# EAGLE design ECEN 4350 Lab 3 (EAGLE 9.6.2)

## Sheet 1 of 8
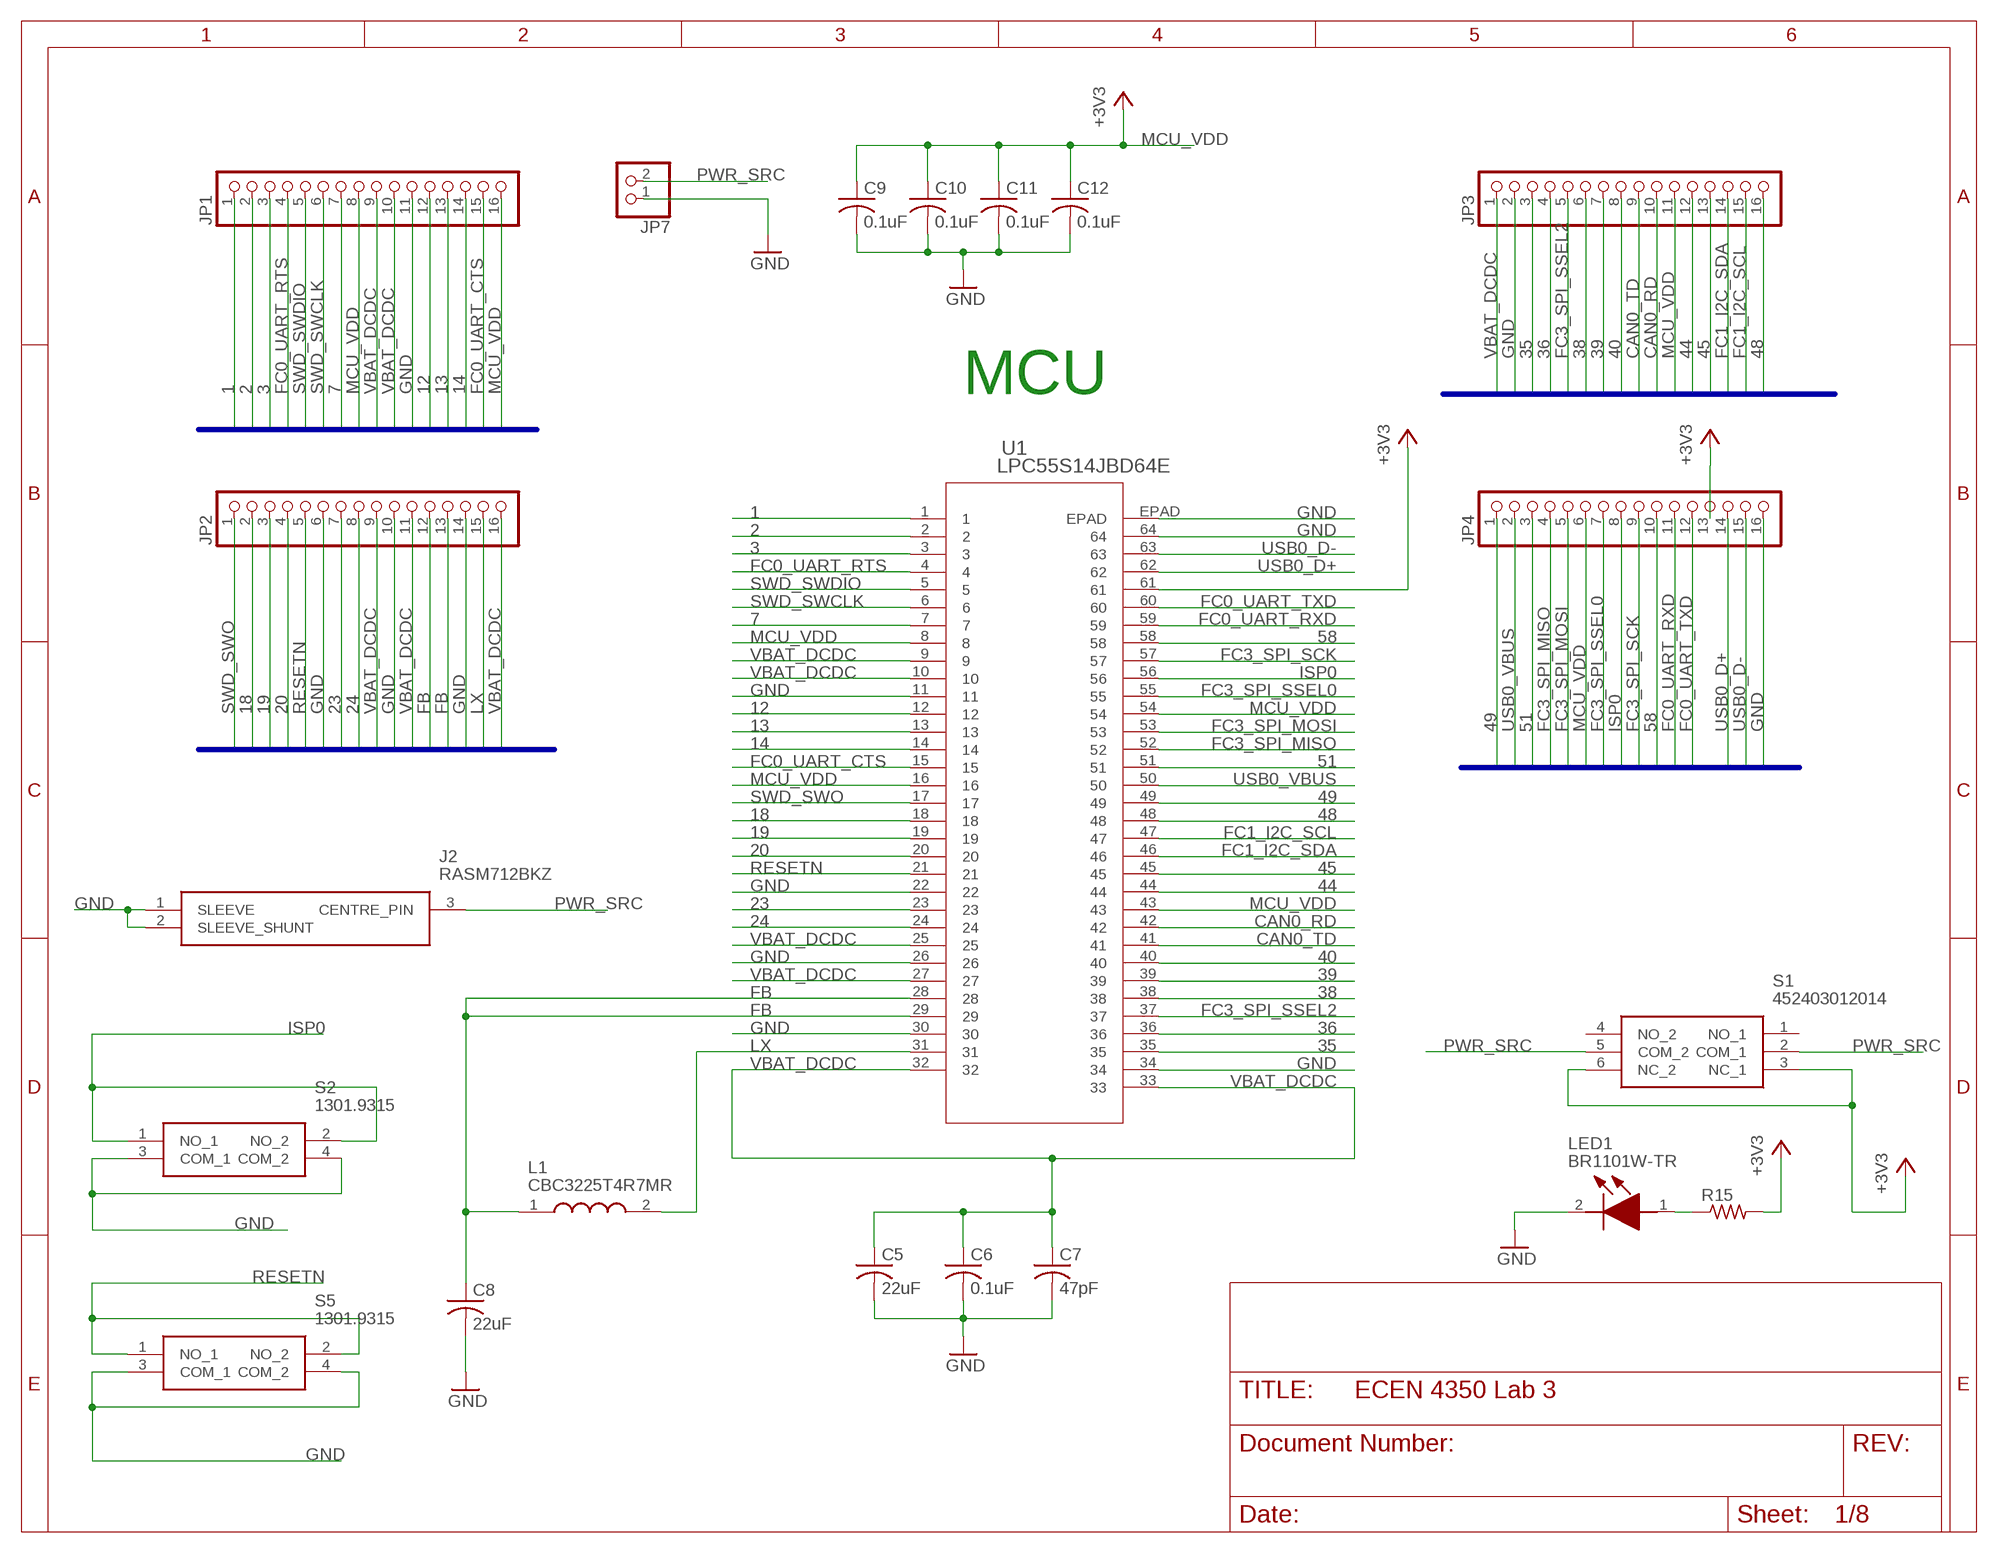
[diagram p0: schematic, sheet 1]

### Parts
C5  22uF  C-USC1206  [C1206]
C6  0.1uF  C-USC1206  [C1206]
C7  47pF  C-USC1206  [C1206]
C8  22uF  C-USC1206  [C1206]
C9  0.1uF  C-USC1206  [C1206]
C10  0.1uF  C-USC1206  [C1206]
C11  0.1uF  C-USC1206  [C1206]
C12  0.1uF  C-USC1206  [C1206]
J2  RASM712BKZ  [RASM712BKZ]
JP1  PINHD-1X16  [1X16]
JP2  PINHD-1X16  [1X16]
JP3  PINHD-1X16  [1X16]
JP4  PINHD-1X16  [1X16]
JP7  PINHD-1X2  [1X02]
L1  CBC3225T4R7MR  [INDC3225X270N]
LED1  BR1101W-TR  [BR1101WTR]
R15  R-US_R1206  [R1206]
S1  452403012014  [452403012014]
S2  1301.9315  [13019319]
S5  1301.9315  [13019319]
U1  LPC55S14JBD64E  [HTQFP64_10X10_NXP]

### Nets
1: JP1.1 U1.1
2: JP1.2 U1.2
3: JP1.3 U1.3
7: JP1.7 U1.7
12: JP1.12 U1.12
13: JP1.13 U1.13
14: JP1.14 U1.14
18: JP2.2 U1.18
19: JP2.3 U1.19
20: JP2.4 U1.20
23: JP2.7 U1.23
24: JP2.8 U1.24
35: JP3.3 U1.35
36: JP3.4 U1.36
38: JP3.6 U1.38
39: JP3.7 U1.39
40: JP3.8 U1.40
44: JP3.12 U1.44
45: JP3.13 U1.45
48: JP3.16 U1.48
49: JP4.1 U1.49
51: JP4.3 U1.51
58: JP4.10 U1.58
+3V3: R15.2 S1.3(NC_1) S1.6(NC_2) U1.61 ; also sheet 3,4,5,6,7,8
CAN0_RD: JP3.10 U1.42 ; also sheet 3
CAN0_TD: JP3.9 U1.41 ; also sheet 3
FB: C8.1 JP2.12 JP2.13 L1.1 U1.28 U1.29
FC0_UART_CTS: JP1.15 U1.15
FC0_UART_RTS: JP1.4 U1.4
FC0_UART_RXD: JP4.11 U1.59 ; also sheet 5
FC0_UART_TXD: JP4.12 U1.60 ; also sheet 5
FC1_I2C_SCL: JP3.15 U1.47 ; also sheet 7,8
FC1_I2C_SDA: JP3.14 U1.46 ; also sheet 7,8
FC3_SPI_MISO: JP4.4 U1.52 ; also sheet 4,7
FC3_SPI_MOSI: JP4.5 U1.53 ; also sheet 4,7
FC3_SPI_SCK: JP4.9 U1.57 ; also sheet 4,7
FC3_SPI_SSEL0: JP4.7 U1.55 ; also sheet 4
FC3_SPI_SSEL2: JP3.5 U1.37 ; also sheet 7
GND: C5.2 C6.2 C7.2 C8.2 C9.2 C10.2 C11.2 C12.2 J2.1(SLEEVE) J2.2(SLEEVE_SHUNT) JP1.11 JP2.6 JP2.10 JP2.14 JP3.2 JP4.16 JP7.1 LED1.2(K) S2.3(COM_1) S2.4(COM_2) S5.3(COM_1) S5.4(COM_2) U1.11 U1.22 U1.26 U1.30 U1.34 U1.64 U1.EPAD ; also sheet 2,3,4,5,6,7,8
ISP0: JP4.8 S2.1(NO_1) S2.2(NO_2) U1.56
LX: JP2.15 L1.2 U1.31
MCU_VDD: C9.1 C10.1 C11.1 C12.1 JP1.8 JP1.16 JP3.11 JP4.6 U1.8 U1.16 U1.43 U1.54 ; supply symbol labelled +3V3
N$20: LED1.1(A) R15.1
N$22: JP4.13
PWR_SRC: J2.3(CENTRE_PIN) JP7.2 S1.2(COM_1) S1.5(COM_2)
RESETN: JP2.5 S5.1(NO_1) S5.2(NO_2) U1.21 ; also sheet 6
SWD_SWCLK: JP1.6 U1.6 ; also sheet 6
SWD_SWDIO: JP1.5 U1.5 ; also sheet 6
SWD_SWO: JP2.1 U1.17 ; also sheet 6
USB0_D+: JP4.14 U1.62 ; also sheet 2
USB0_D-: JP4.15 U1.63 ; also sheet 2
USB0_VBUS: JP4.2 U1.50 ; also sheet 2
VBAT_DCDC: C5.1 C6.1 C7.1 JP1.9 JP1.10 JP2.9 JP2.11 JP2.16 JP3.1 U1.9 U1.10 U1.25 U1.27 U1.32 U1.33
Unconnected: S1.1(NO_1) S1.4(NO_2)

### Buses
MCU1:1,2,3,7,8,9,10,11,12,13,14,16,FC0_UART_CTS,FC0_UART_RTS,SWD_SWCLK,SWD_SWDIO
MCU2:18,19,20,FB,LX,RESETN,SWD_SWO,USB1_DP,USB1_VSS,VBAT_DCDC,VSS_DCDC
34,35,36,38,39,40,43,44,45,48,CAN0_RD,CAN0_TD,FC1_I2C_SCL,FC1_I2C_SDA,FC3_SPI_SSEL2,GND,VBAT_PMU
49,51,58,FC0_UART_RXD,FC0_UART_TXD,FC3_SPI_MISO,FC3_SPI_MOSI,FC3_SPI_SCK,FC3_SPI_SSEL0,ISP0,USB0_3V3,USB0_D-,USB0_D+,USB0_VBUS,USB0_VSS,VDD

### Notes on the sheet
- MCU

## Sheet 2 of 8
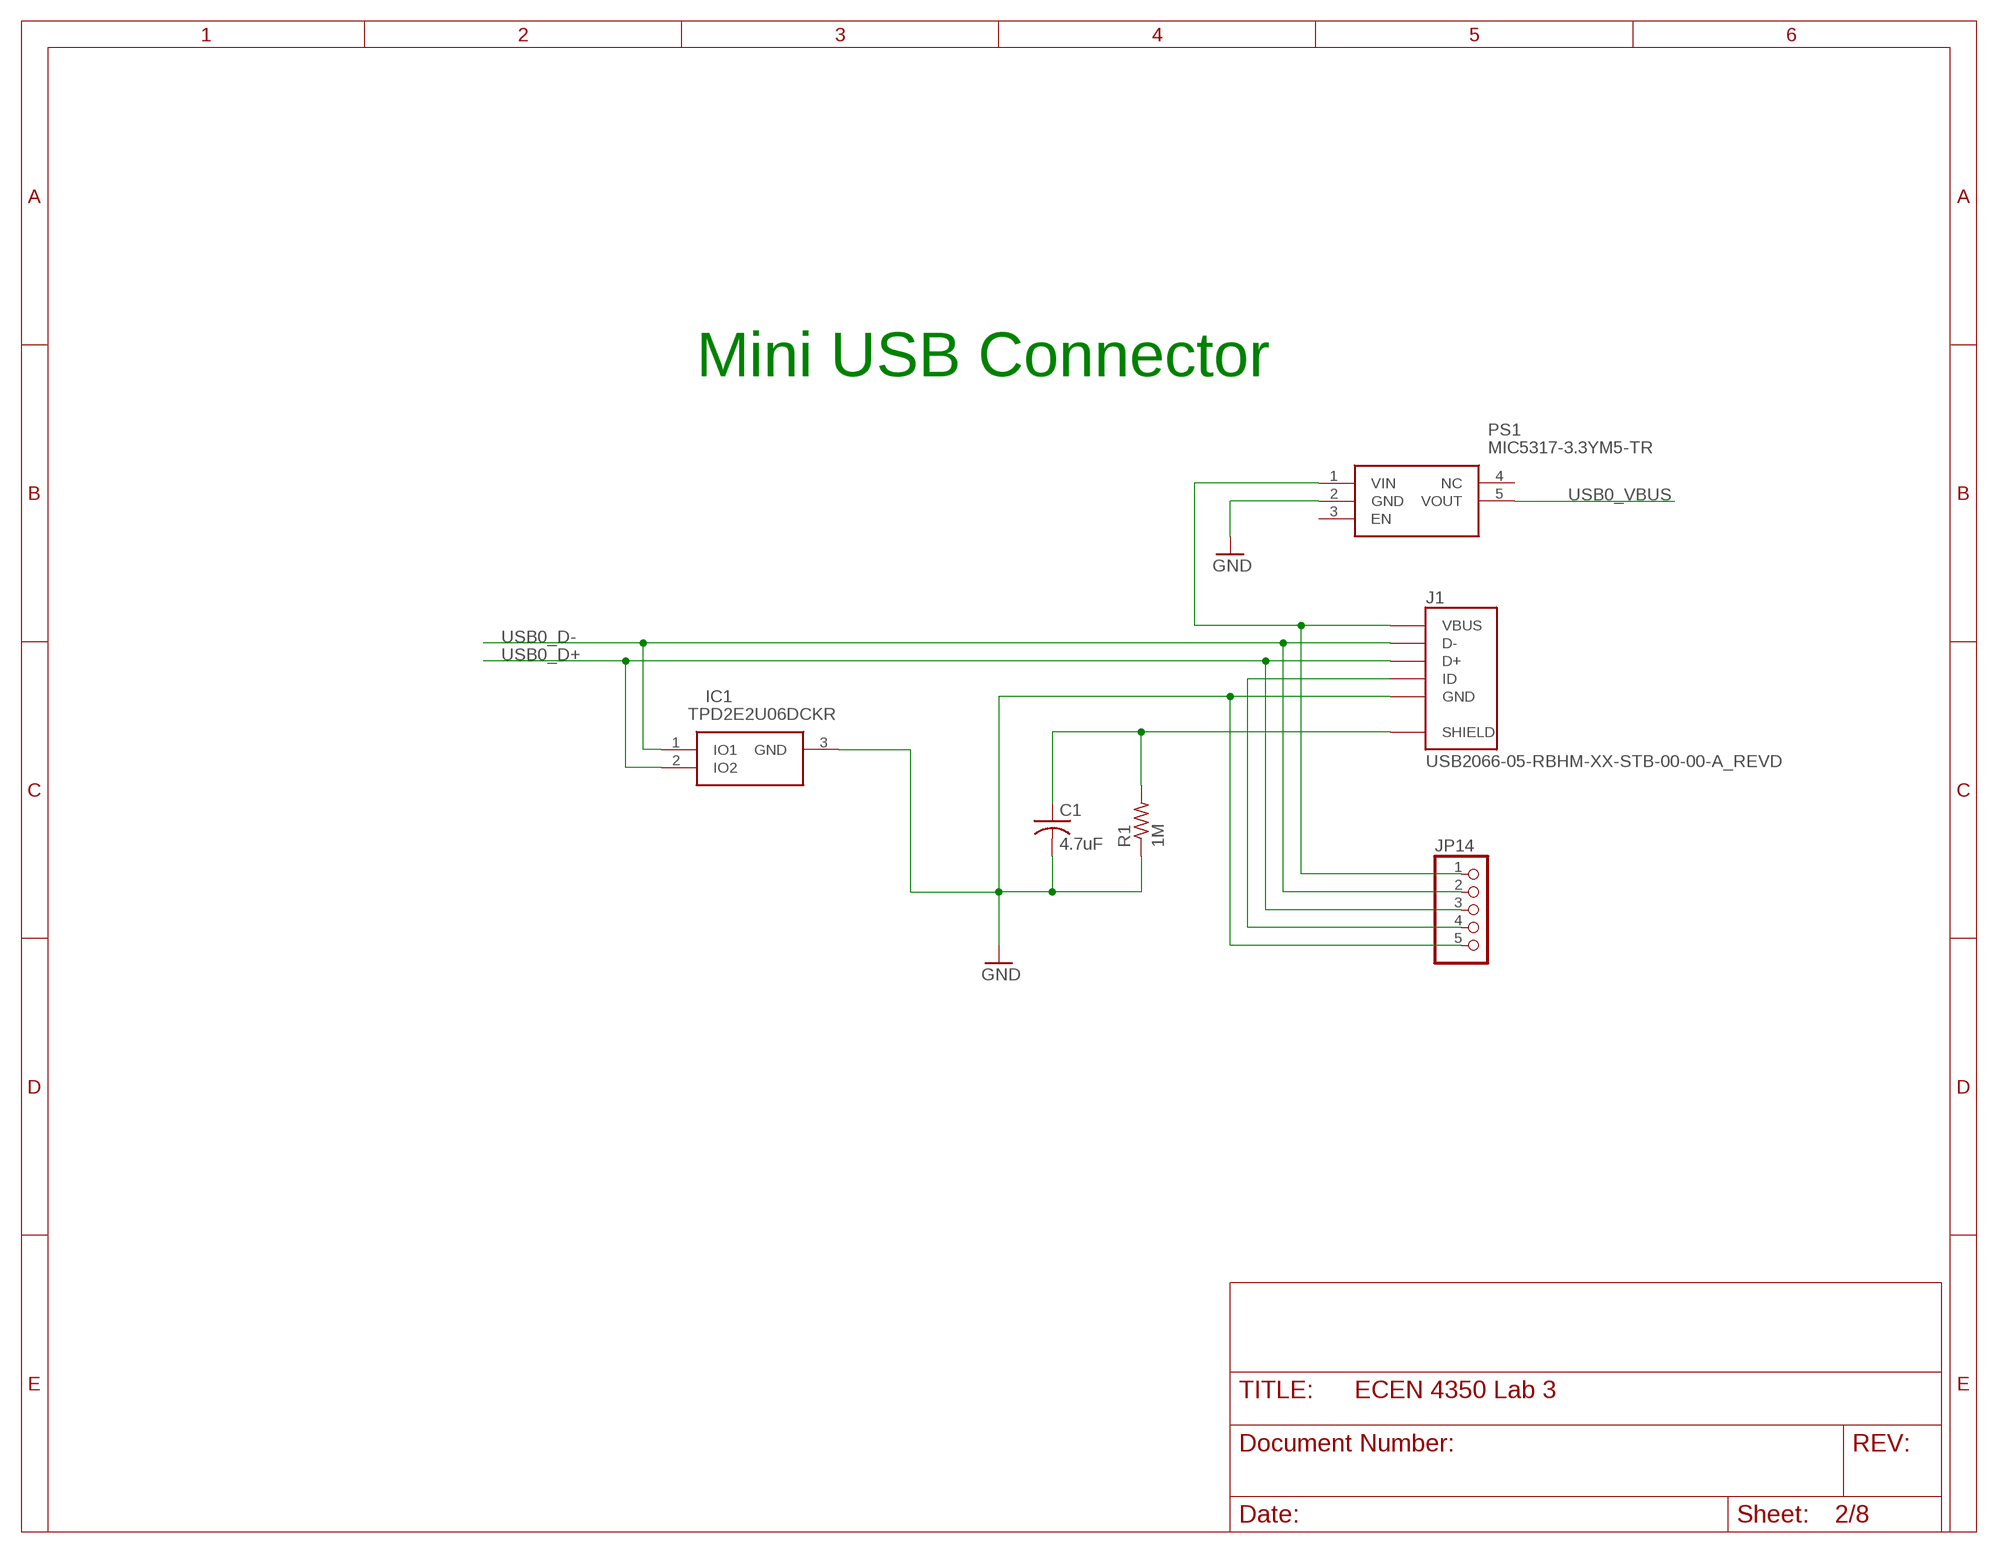
[diagram p1: schematic, sheet 2]

### Parts
C1  4.7uF  C-USC1206  [C1206]
IC1  TPD2E2U06DCKR  [SOT65P210X110-3N]
J1  USB2066-05-RBHM-XX-STB-00-00-A_REVD  [GCT_USB2066-05-RBHM-XX-STB-00-00-A_REVD]
JP14  PINHD-1X5  [1X05]
PS1  MIC5317-3.3YM5-TR  [SOT95P280X100-5N]
R1  1M  R-US_R1206  [R1206]

### Nets
+5V: J1.1(VBUS) JP14.1 PS1.1(VIN)
GND: C1.2 IC1.3(GND) J1.5(GND) JP14.5 PS1.2(GND) R1.1 ; also sheet 1,3,4,5,6,7,8
N$7: C1.1 J1.6(SHIELD) J1.7(SHIELD) J1.8(SHIELD) J1.9(SHIELD) R1.2
N$12: J1.4(ID) JP14.4
USB0_D+: IC1.2(IO2) J1.3(D+) JP14.3 ; also sheet 1
USB0_D-: IC1.1(IO1) J1.2(D-) JP14.2 ; also sheet 1
USB0_VBUS: PS1.5(VOUT) ; also sheet 1
Unconnected: PS1.3(EN) PS1.4(NC)

### Notes on the sheet
- Mini USB Connector

## Sheet 3 of 8
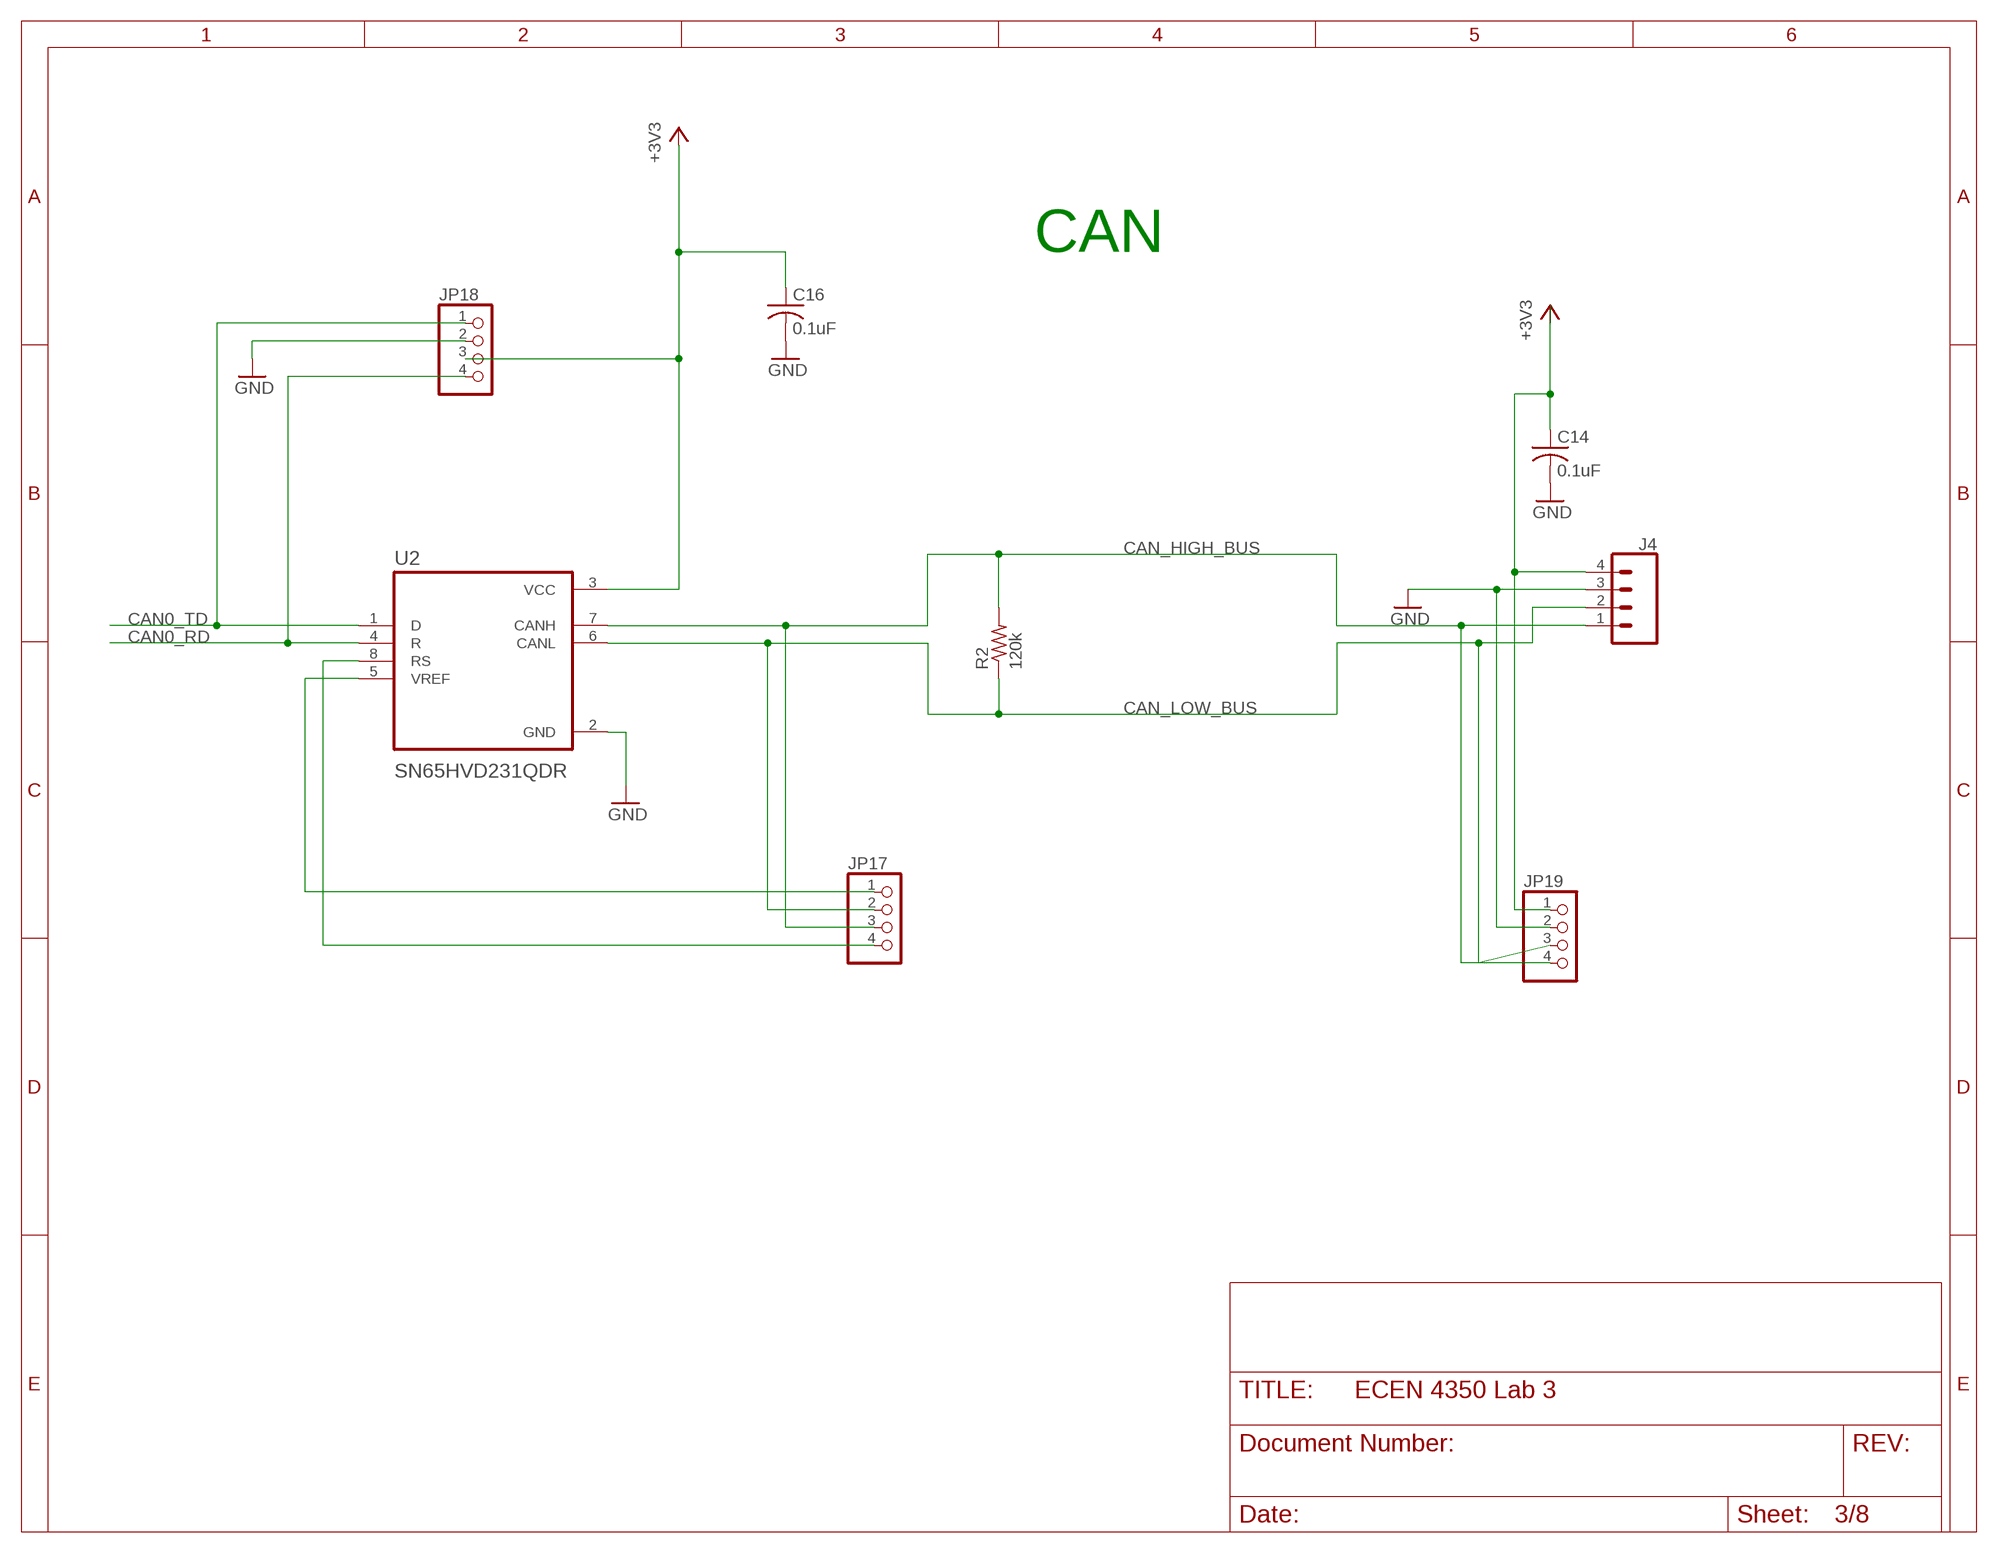
[diagram p2: schematic, sheet 3]

### Parts
C14  0.1uF  C-USC1206  [C1206]
C16  0.1uF  C-USC1206  [C1206]
J4  CONN_04SMD2  [JST04_1MM_RA]
JP17  PINHD-1X4  [1X04]
JP18  PINHD-1X4  [1X04]
JP19  PINHD-1X4  [1X04]
R2  120k  R-US_R1206  [R1206]
U2  SN65HVD231QDR  [SOIC127P599X175-8N]

### Nets
+3V3: C14.1 C16.1 J4.4 JP18.3 JP19.1 U2.3(VCC) ; also sheet 1,4,5,6,7,8
CAN0_RD: JP18.4 U2.4(R) ; also sheet 1
CAN0_TD: JP18.1 U2.1(D) ; also sheet 1
CAN_HIGH_BUS: J4.1 JP17.3 JP19.4 R2.2 U2.7(CANH)
CAN_LOW_BUS: J4.2 JP17.2 JP19.3 R2.1 U2.6(CANL)
GND: C14.2 C16.2 J4.3 JP18.2 JP19.2 U2.2(GND) ; also sheet 1,2,4,5,6,7,8
N$5: JP17.4 U2.8(RS)
N$6: JP17.1 U2.5(VREF)

### Notes on the sheet
- CAN

## Sheet 4 of 8
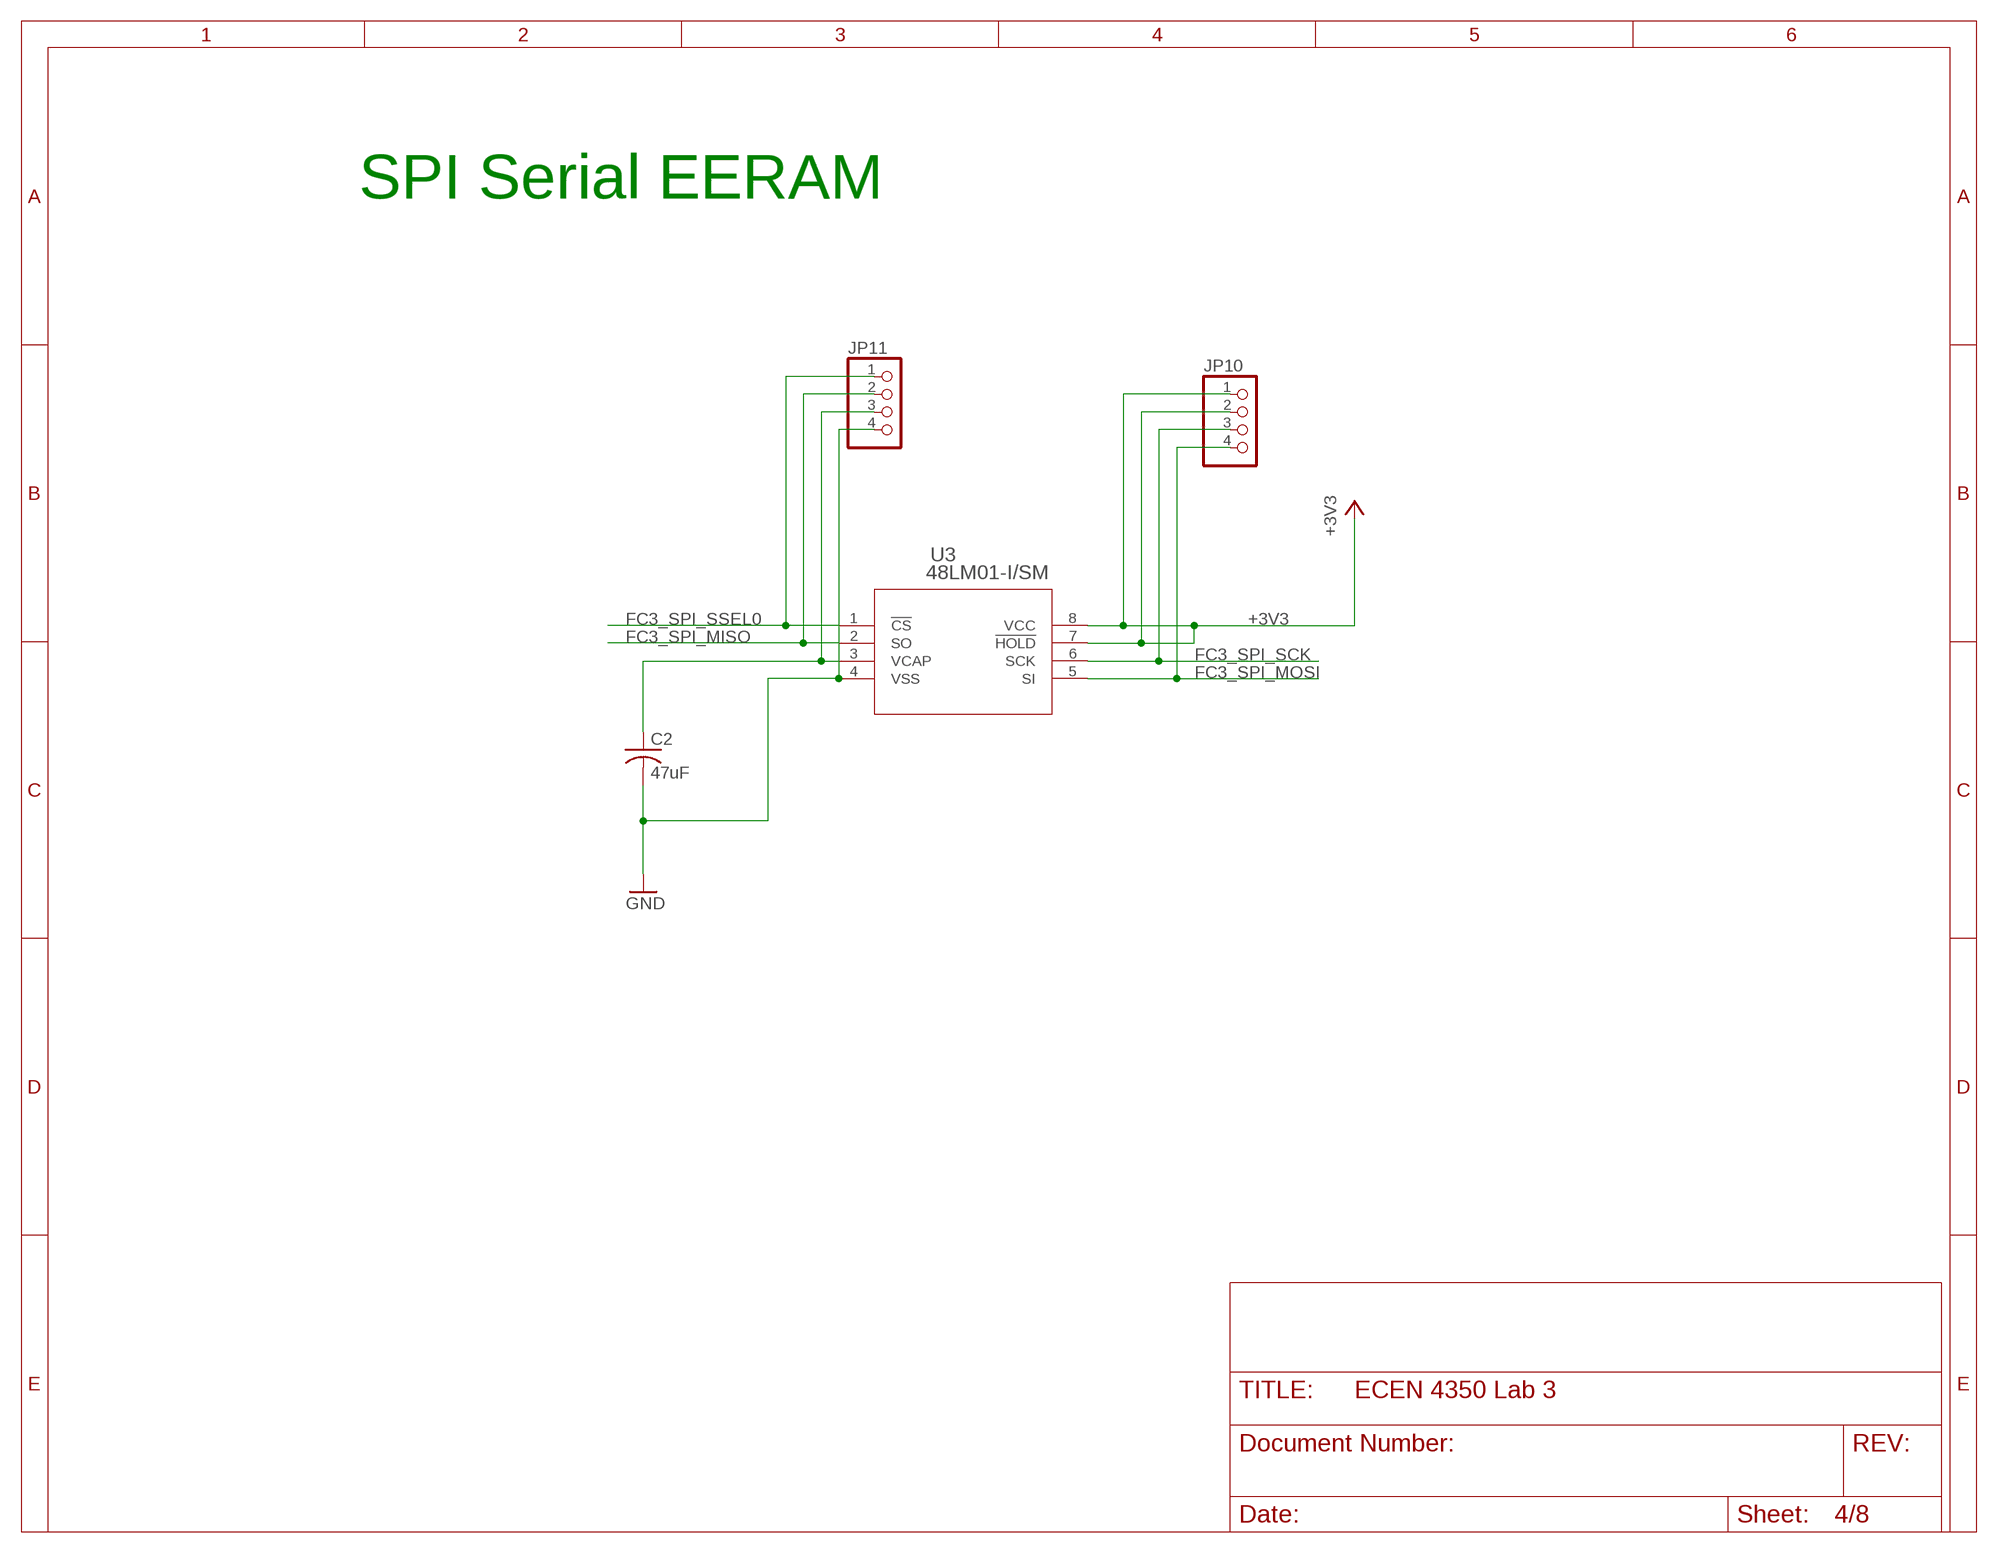
[diagram p3: schematic, sheet 4]

### Parts
C2  47uF  C-USC1206  [C1206]
JP10  PINHD-1X4  [1X04]
JP11  PINHD-1X4  [1X04]
U3  48LM01-I/SM  [SOIJ8_SM_MCH]

### Nets
+3V3: JP10.1 JP10.2 U3.7(!HOLD) U3.8(VCC) ; also sheet 1,3,5,6,7,8
FC3_SPI_MISO: JP11.2 U3.2(SO) ; also sheet 1,7
FC3_SPI_MOSI: JP10.4 U3.5(SI) ; also sheet 1,7
FC3_SPI_SCK: JP10.3 U3.6(SCK) ; also sheet 1,7
FC3_SPI_SSEL0: JP11.1 U3.1(!CS) ; also sheet 1
GND: C2.2 JP11.4 U3.4(VSS) ; also sheet 1,2,3,5,6,7,8
N$3: C2.1 JP11.3 U3.3(VCAP)

### Notes on the sheet
- SPI Serial EERAM

## Sheet 5 of 8
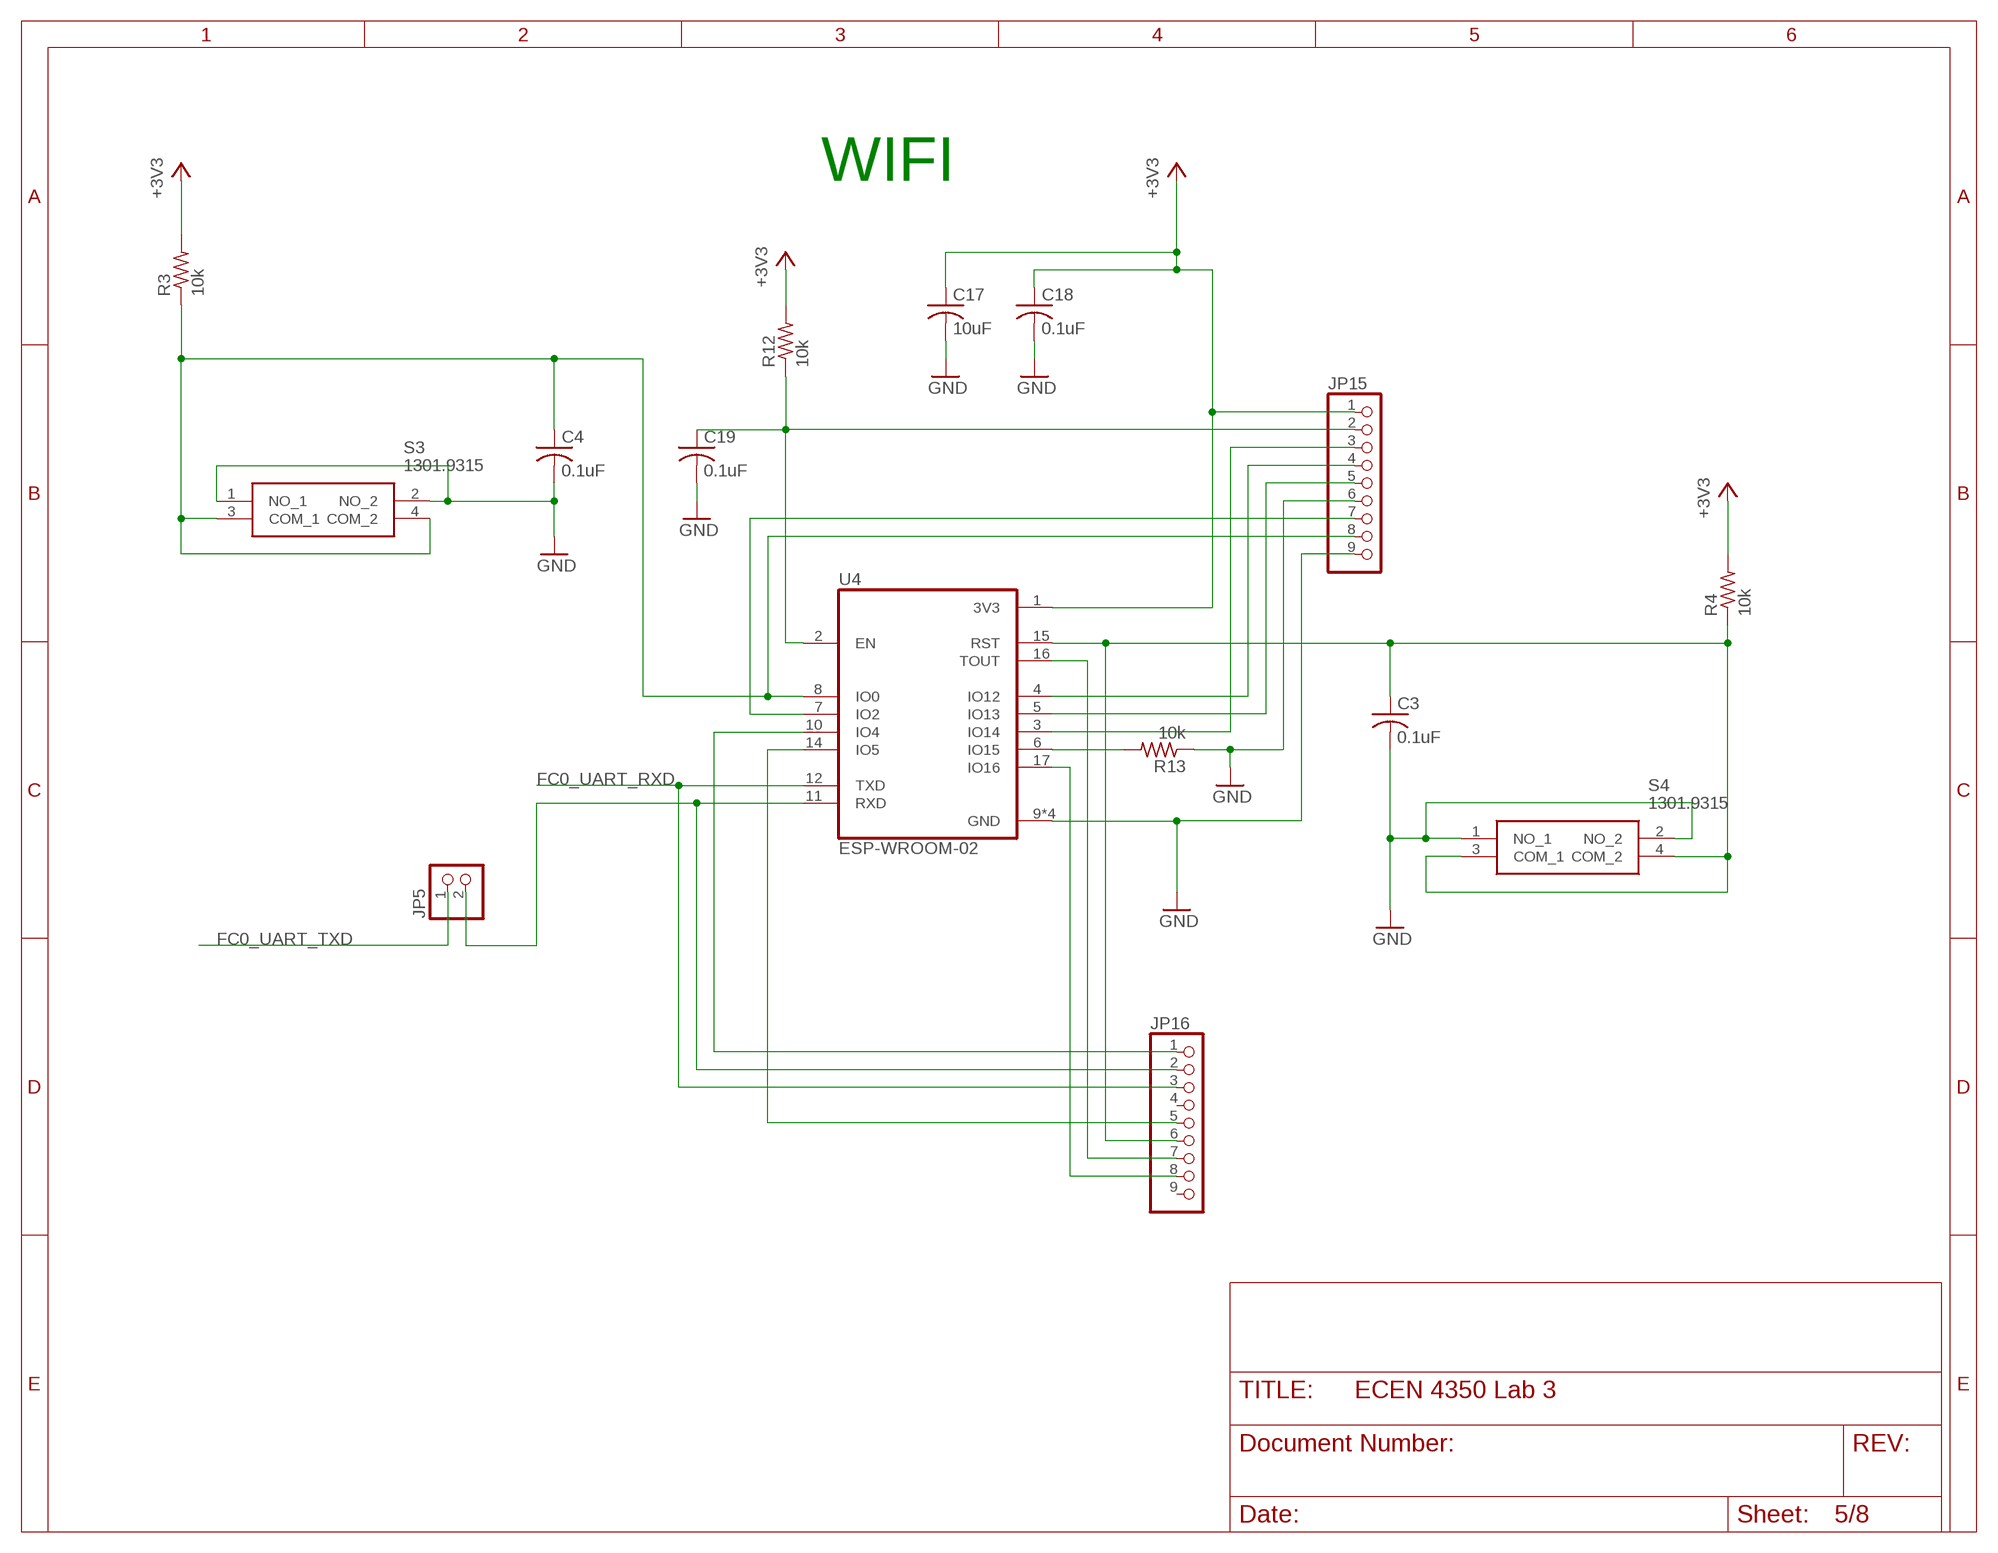
[diagram p4: schematic, sheet 5]

### Parts
C3  0.1uF  C-USC1206  [C1206]
C4  0.1uF  C-USC1206  [C1206]
C17  10uF  C-USC1206  [C1206]
C18  0.1uF  C-USC1206  [C1206]
C19  0.1uF  C-USC1206  [C1206]
JP5  PINHD-1X2  [1X02]
JP15  PINHD-1X9  [1X09]
JP16  PINHD-1X9  [1X09]
R3  10k  R-US_M1206  [M1206]
R4  10k  R-US_M1206  [M1206]
R12  10k  R-US_M1206  [M1206]
R13  10k  R-US_M1206  [M1206]
S3  1301.9315  [13019319]
S4  1301.9315  [13019319]
U4  ESP-WROOM-02  [MODULE_ESP-WROOM-02]

### Nets
+3V3: C17.1 C18.1 JP15.1 R3.2 R4.2 R12.2 U4.1(3V3) ; also sheet 1,3,4,6,7,8
FC0_UART_RXD: JP16.3 U4.12(TXD) ; also sheet 1
FC0_UART_TXD: JP5.1 ; also sheet 1
GND: C3.2 C4.2 C17.2 C18.2 C19.2 JP15.6 JP15.9 R13.1 S3.1(NO_1) S3.2(NO_2) S4.1(NO_1) S4.2(NO_2) U4.9(GND) U4.13(GND) U4.18(GND) U4.19(GND) ; also sheet 1,2,3,4,6,7,8
N$1: JP5.2 JP16.2 U4.11(RXD)
N$8: C4.1 JP15.8 R3.1 S3.3(COM_1) S3.4(COM_2) U4.8(IO0)
N$9: C19.1 JP15.2 R12.1 U4.2(EN)
N$10: JP15.3 U4.3(IO14)
N$11: C3.1 JP16.6 R4.1 S4.3(COM_1) S4.4(COM_2) U4.15(RST)
N$13: JP15.4 U4.4(IO12)
N$14: JP15.5 U4.5(IO13)
N$15: JP15.7 U4.7(IO2)
N$16: JP16.1 U4.10(IO4)
N$17: JP16.5 U4.14(IO5)
N$18: JP16.7 U4.16(TOUT)
N$19: JP16.8 U4.17(IO16)
N$21: R13.2 U4.6(IO15)
Unconnected: JP16.4 JP16.9

### Notes on the sheet
- WIFI

## Sheet 6 of 8
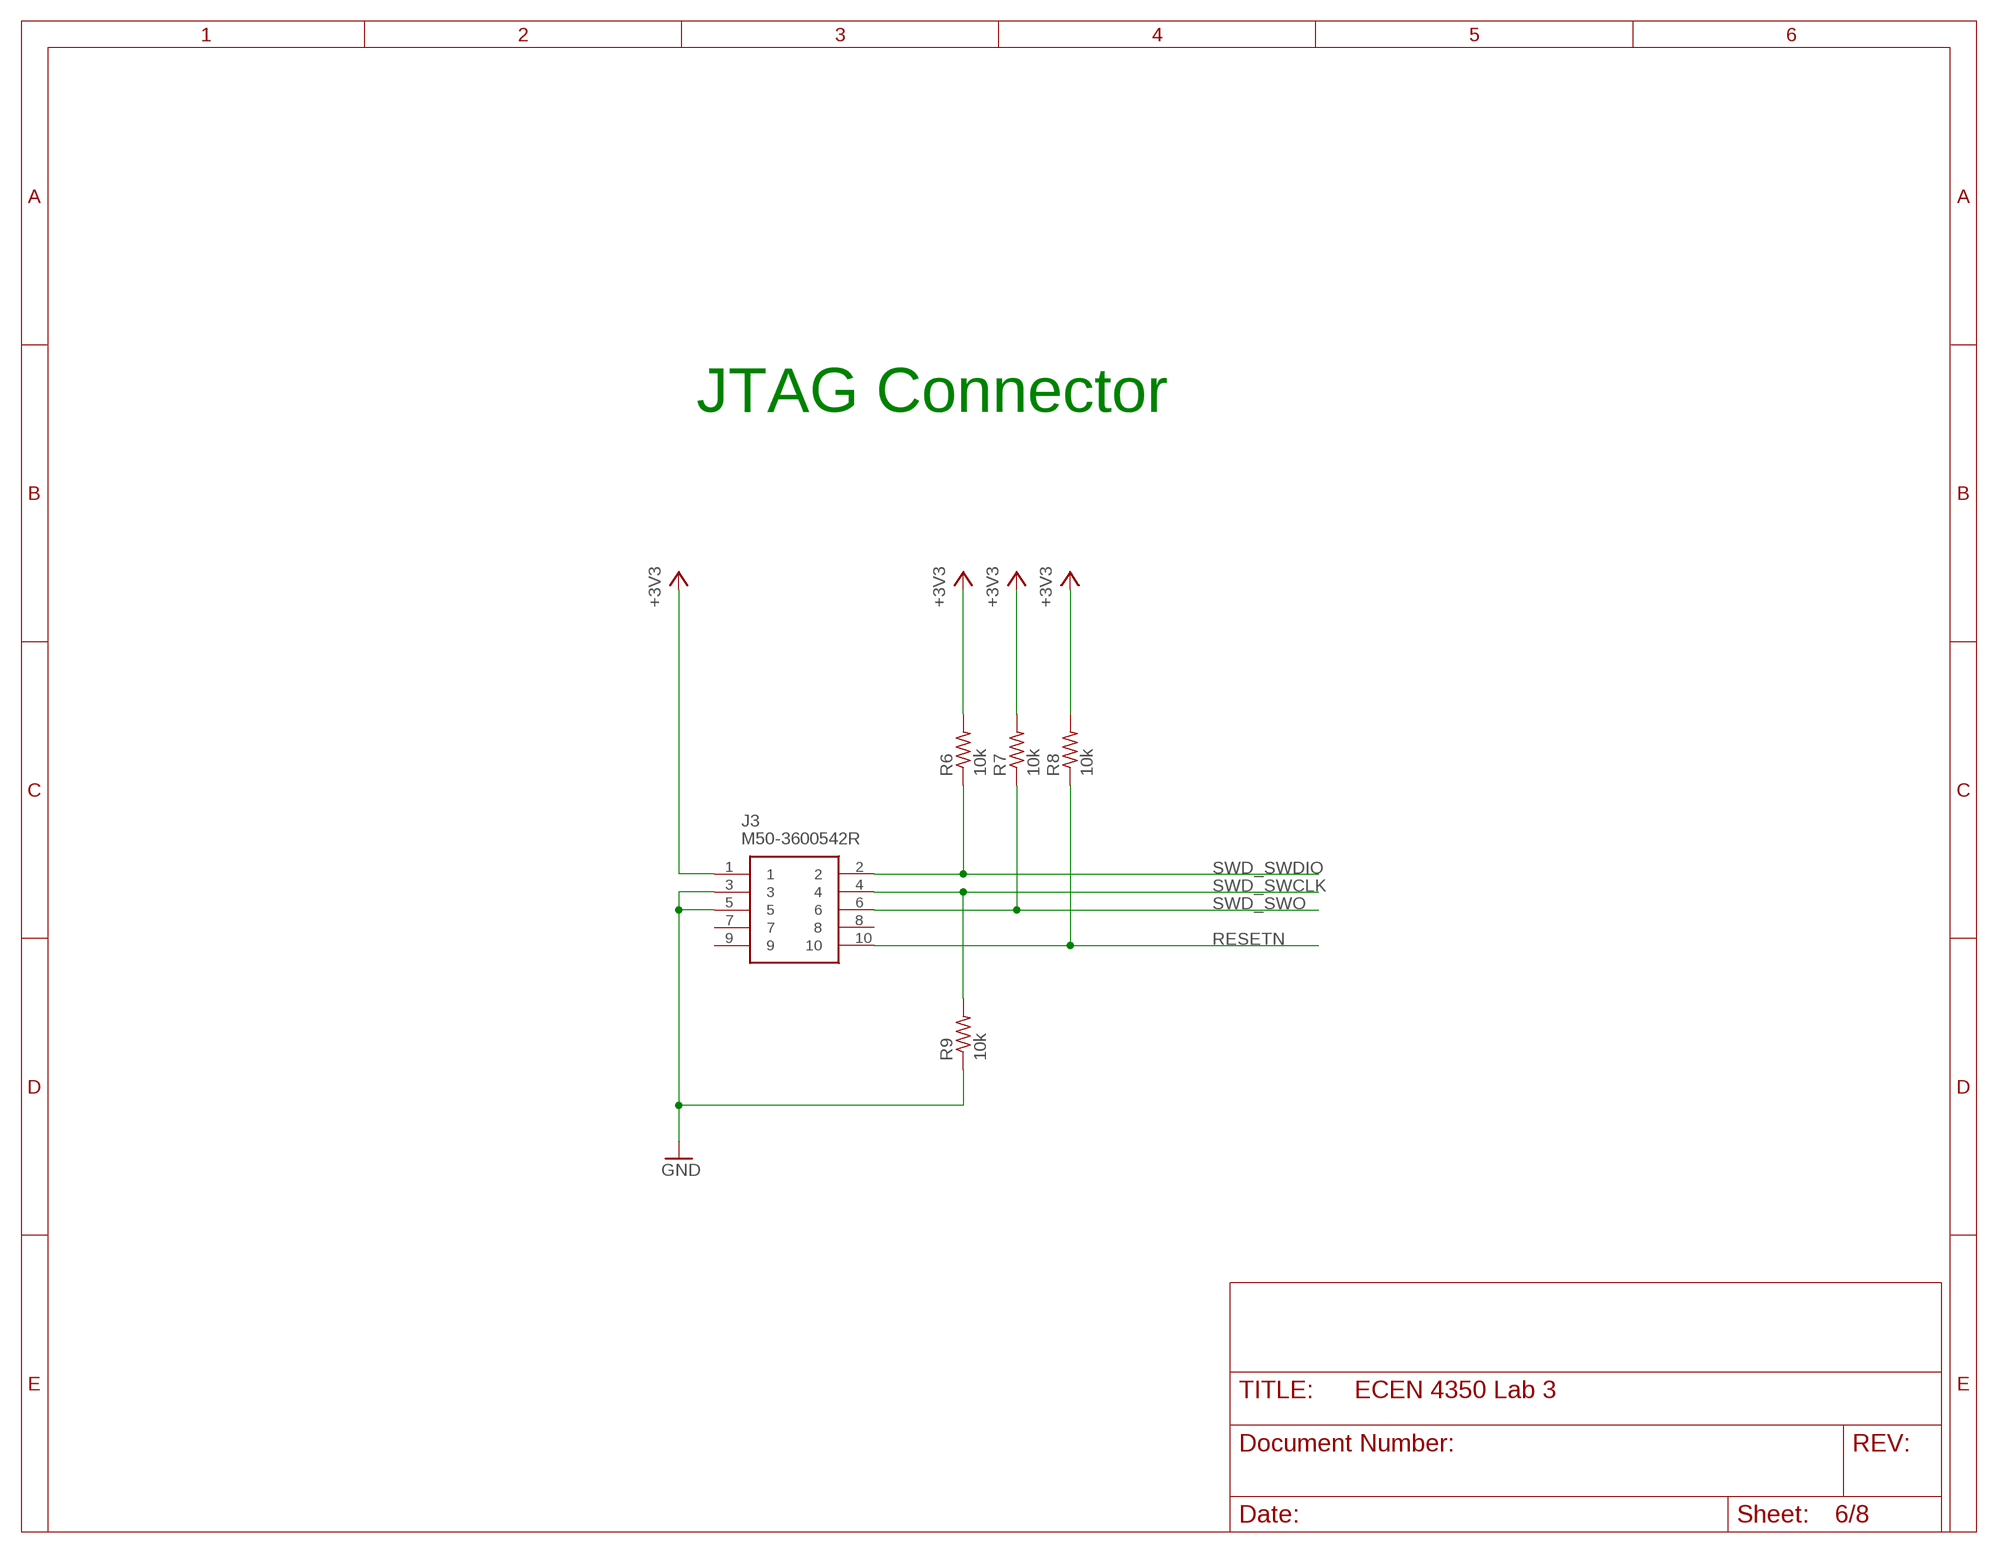
[diagram p5: schematic, sheet 6]

### Parts
J3  M50-3600542R  [HUSSP10W40P127_2X5_635X340X420]
R6  10k  R-US_M1206  [M1206]
R7  10k  R-US_M1206  [M1206]
R8  10k  R-US_M1206  [M1206]
R9  10k  R-US_M1206  [M1206]

### Nets
+3V3: J3.1 R6.2 R7.2 R8.2 ; also sheet 1,3,4,5,7,8
GND: J3.3 J3.5 R9.1 ; also sheet 1,2,3,4,5,7,8
RESETN: J3.10 R8.1 ; also sheet 1
SWD_SWCLK: J3.4 R9.2 ; also sheet 1
SWD_SWDIO: J3.2 R6.1 ; also sheet 1
SWD_SWO: J3.6 R7.1 ; also sheet 1
Unconnected: J3.7 J3.8 J3.9

### Notes on the sheet
- JTAG Connector

## Sheet 7 of 8
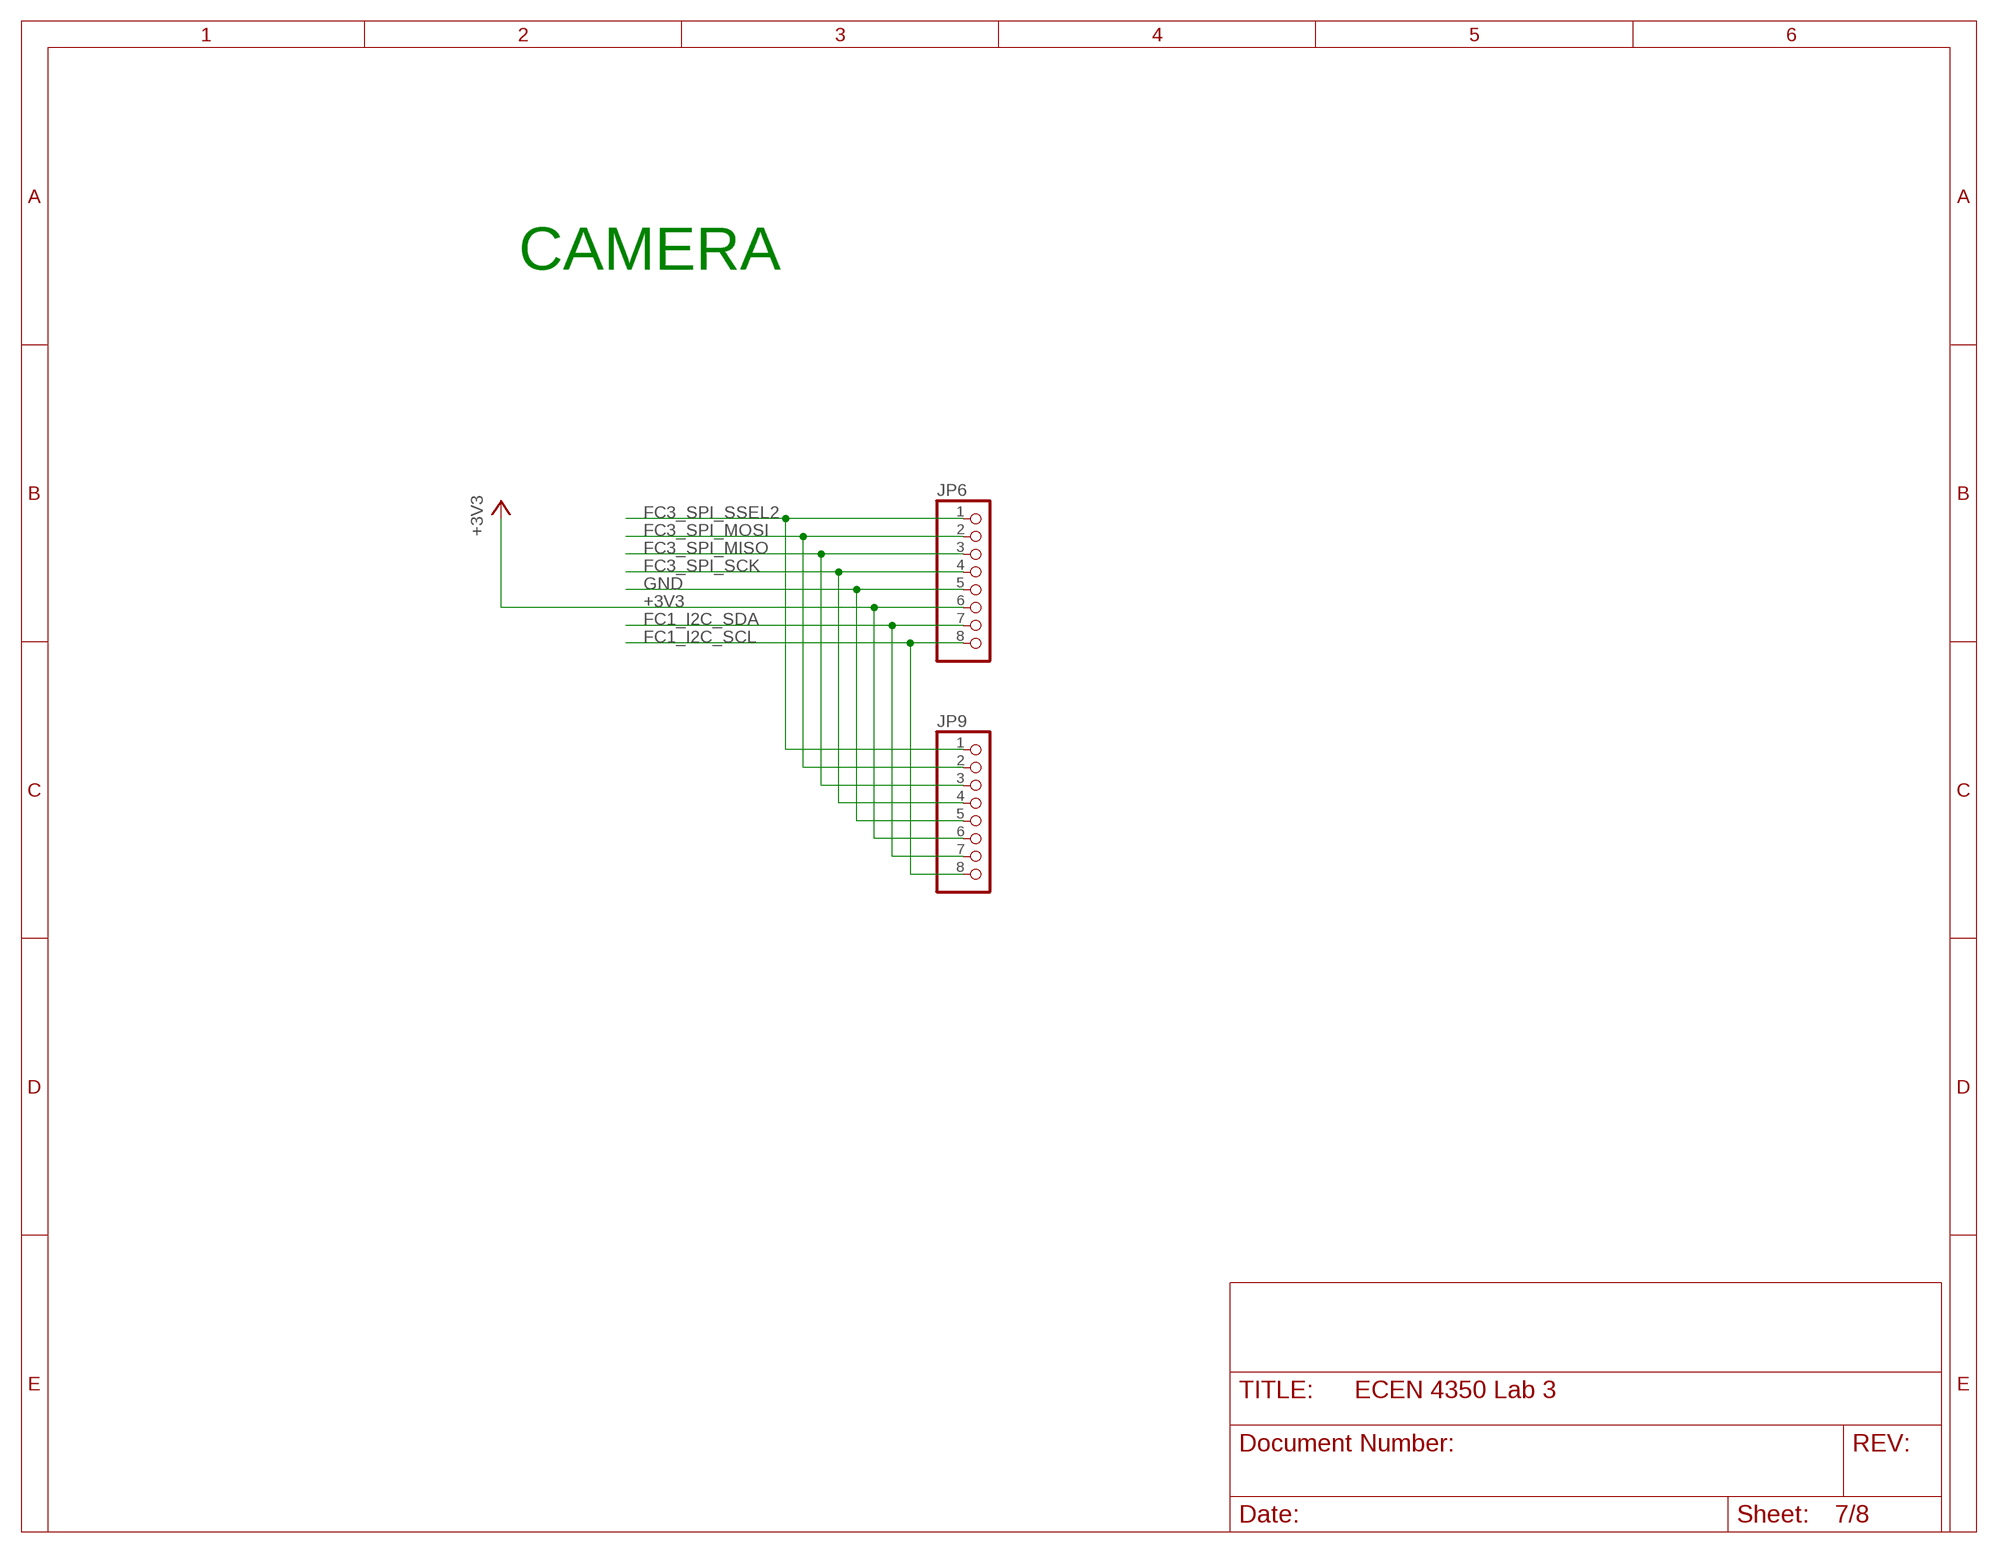
[diagram p6: schematic, sheet 7]

### Parts
JP6  PINHD-1X8  [1X08]
JP9  PINHD-1X8  [1X08]

### Nets
+3V3: JP6.6 JP9.6 ; also sheet 1,3,4,5,6,8
FC1_I2C_SCL: JP6.8 JP9.8 ; also sheet 1,8
FC1_I2C_SDA: JP6.7 JP9.7 ; also sheet 1,8
FC3_SPI_MISO: JP6.3 JP9.3 ; also sheet 1,4
FC3_SPI_MOSI: JP6.2 JP9.2 ; also sheet 1,4
FC3_SPI_SCK: JP6.4 JP9.4 ; also sheet 1,4
FC3_SPI_SSEL2: JP6.1 JP9.1 ; also sheet 1
GND: JP6.5 JP9.5 ; also sheet 1,2,3,4,5,6,8

### Notes on the sheet
- CAMERA

## Sheet 8 of 8
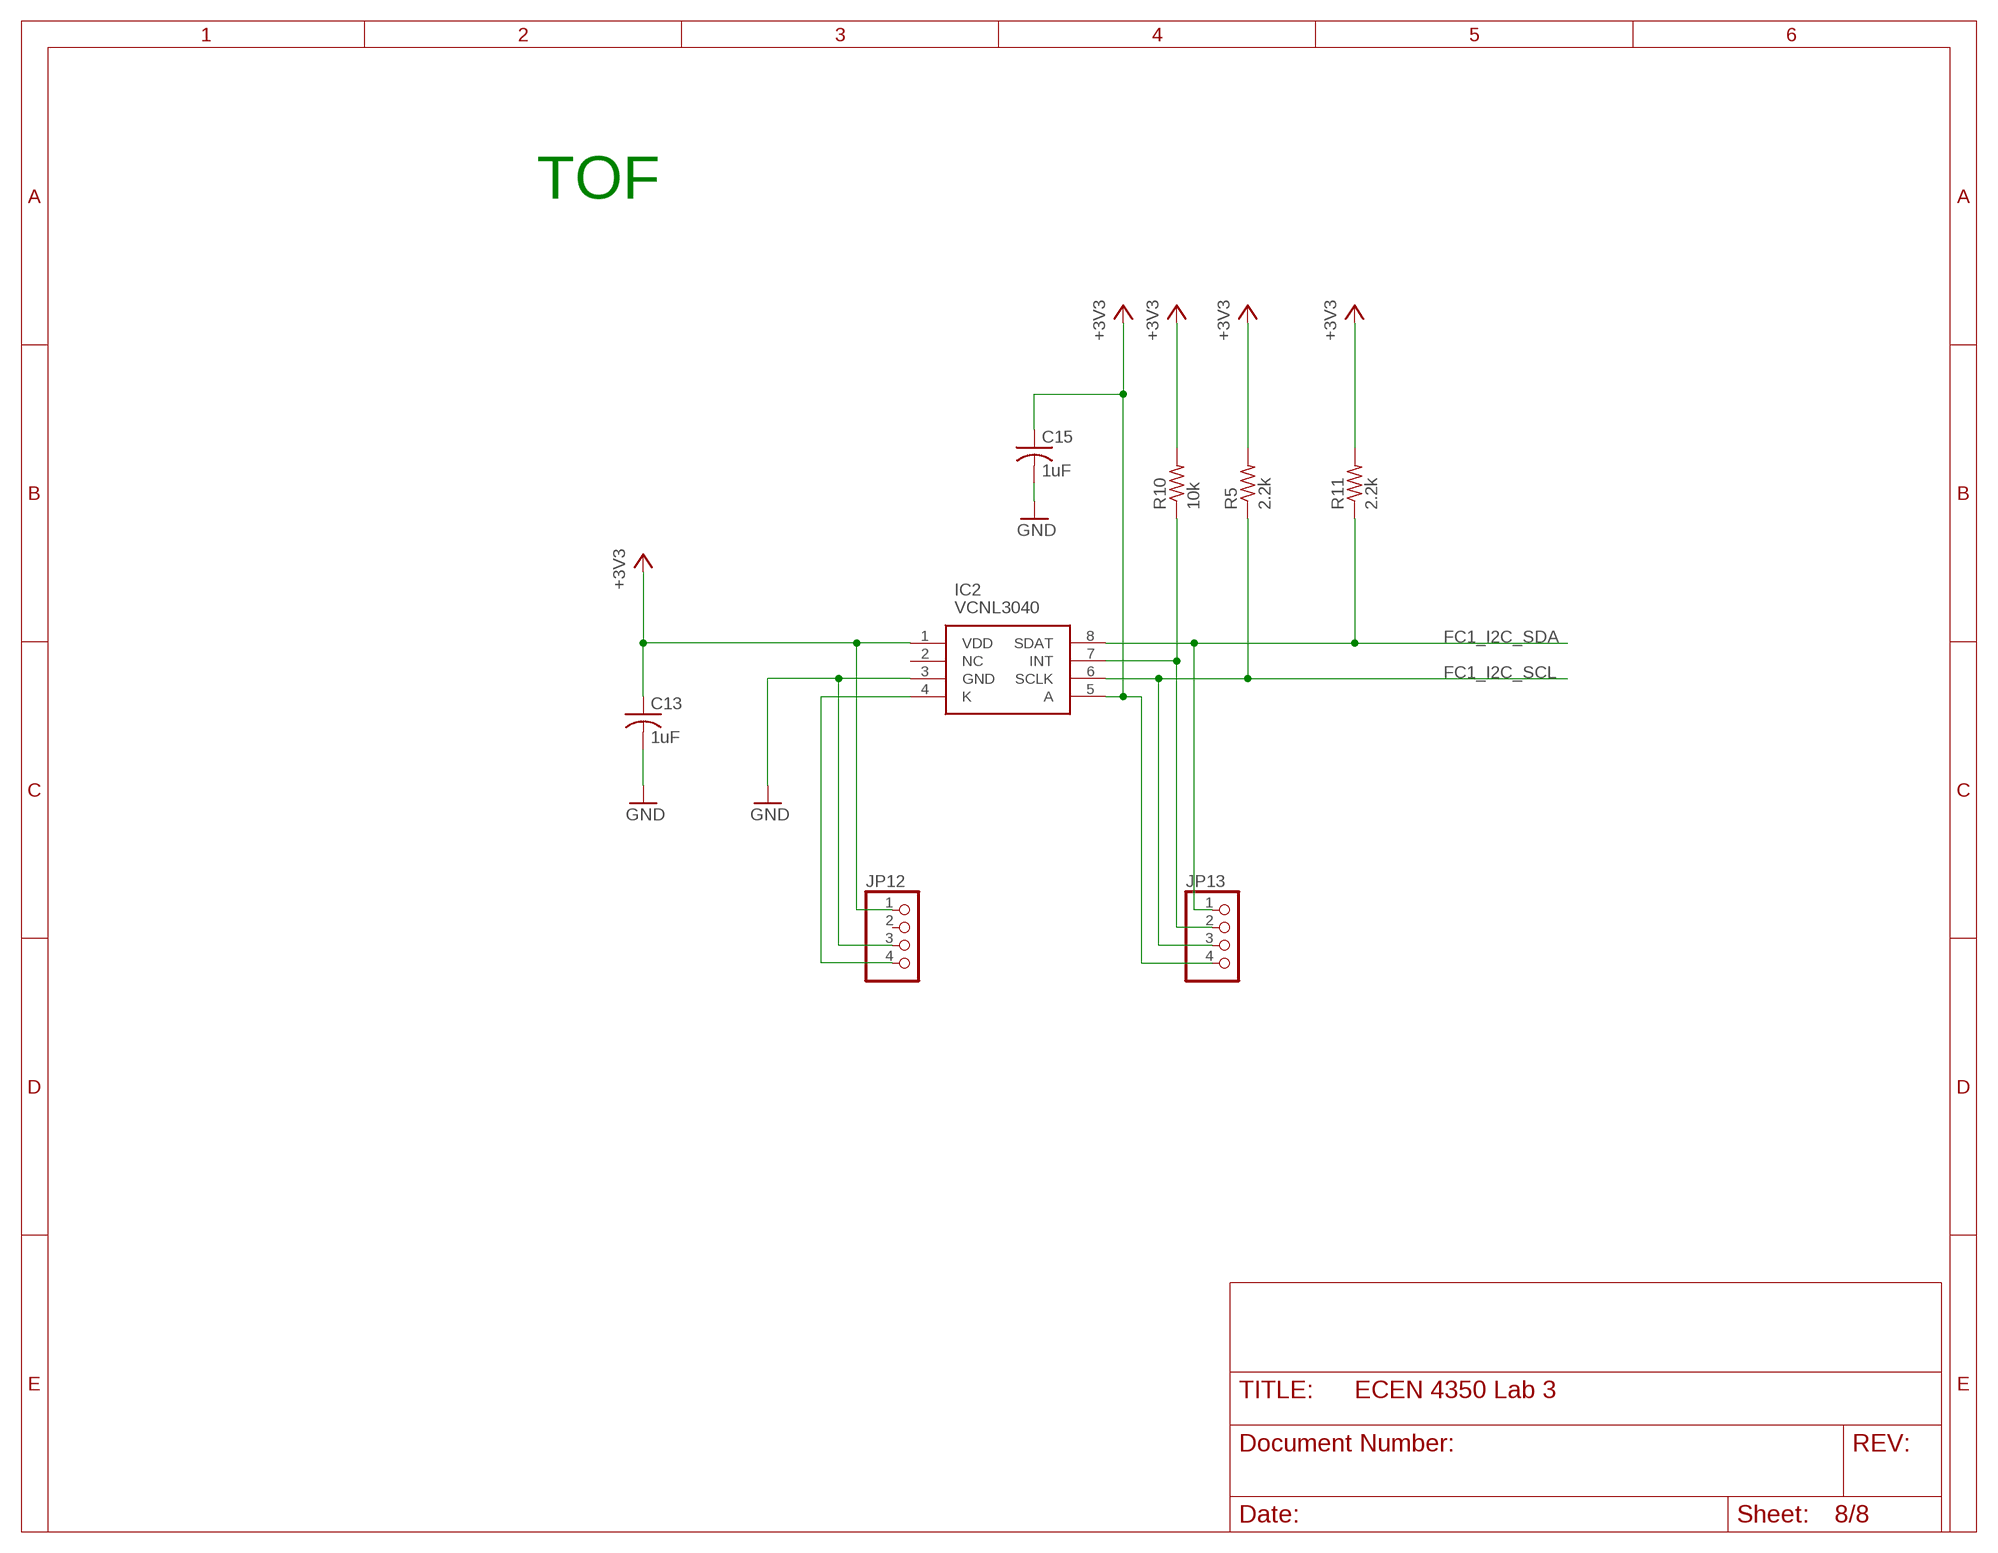
[diagram p7: schematic, sheet 8]

### Parts
C13  1uF  C-USC1206  [C1206]
C15  1uF  C-USC1206  [C1206]
IC2  VCNL3040  [SON108P200X400X115-8N]
JP12  PINHD-1X4  [1X04]
JP13  PINHD-1X4  [1X04]
R5  2.2k  R-US_M1206  [M1206]
R10  10k  R-US_M1206  [M1206]
R11  2.2k  R-US_M1206  [M1206]

### Nets
+3V3: C13.1 C15.1 IC2.1(VDD) IC2.5(A) JP12.1 JP13.4 R5.2 R10.2 R11.2 ; also sheet 1,3,4,5,6,7
FC1_I2C_SCL: IC2.6(SCLK) JP13.3 R5.1 ; also sheet 1,7
FC1_I2C_SDA: IC2.8(SDAT) JP13.1 R11.1 ; also sheet 1,7
GND: C13.2 C15.2 IC2.3(GND) JP12.3 ; also sheet 1,2,3,4,5,6,7
N$2: IC2.7(INT) JP13.2 R10.1
N$4: IC2.4(K) JP12.4
Unconnected: IC2.2(NC) JP12.2

### Notes on the sheet
- TOF

## Library data of the parts
C1-C19 = rcl:C-US: CAPACITOR, American symbol; SPICEPREFIX: C
IC1 = SamacSys_Parts:TPD2E2U06DCKR: ESD Suppressors / TVS Diodes Source: Datasheet <https://www.ti.com/lit/gpn/TPD2E2U06>; DESCRIPTION: ESD Suppressors / TVS Diodes; HEIGHT: 1.1mm; MANUFACTURER_NAME: Texas Instruments; MANUFACTURER_PART_NUMBER: TPD2E2U06DCKR; MOUSER_PART_NUMBER: 595-TPD2E2U06DCKR; MOUSER_PRICE-STOCK: https://www.mouser.co.uk/ProductDetail/Texas-Instruments/TPD2E2U06DCKR?qs=xZ%2FP%252Ba9zWqa9UMTS1HgCWA%3D%3D
IC2 = SamacSys_Parts:VCNL3040: VISHAY - VCNL3040 - Proximity Sensor, I2C, 300 mm, QFN, 8 Pins, 2.5 V, 3.6 V Source: Datasheet; DESCRIPTION: VISHAY - VCNL3040 - Proximity Sensor, I2C, 300 mm, QFN, 8 Pins, 2.5 V, 3.6 V; HEIGHT: 1.15mm; MANUFACTURER_NAME: Vishay; MANUFACTURER_PART_NUMBER: VCNL3040; MOUSER_PART_NUMBER: 78-VCNL3040; MOUSER_PRICE-STOCK: https://www.mouser.co.uk/ProductDetail/Vishay-Semiconductors/VCNL3040?qs=bZr6mbWTK5m90GodUNdcvA%3D%3D
J1 = USB2066-05-RBHM-XX-STB-00-00-A_REVD:USB2066-05-RBHM-XX-STB-00-00-A_REVD: Mimi USB Receptacle, Type B, 5 Pin, SMT, Horizontal, Optional Post, 9.40mm Length; DESCRIPTION: USB - mini B USB 2.0 Receptacle Connector 5 Position Surface Mount, Right Angle; DIGI-KEY_PART_NUMBER: 2073-USB2066-05-RBHM-15-STB-00-00-ACT-ND; MF: Global Connector Technology; MP: USB2066-05-RBHM-15-STB-00-00-A; PACKAGE: None; PURCHASE-URL: https://pricing.snapeda.com/search/part/USB2066-05-RBHM-15-STB-00-00-A/?ref=eda
J2 = SamacSys_Parts:RASM712BKZ: SWITCHCRAFT/CONXALL - RASM712BKZ - DC POWER JACK, BKZ LOCKING SERIES, 2.5MM SURFACE MOUNT 99AC7761 Source: Datasheet <https://www.mouser.de/datasheet/2/393/RASM712BKZ_CD-1545617.pdf>; DESCRIPTION: SWITCHCRAFT/CONXALL - RASM712BKZ - DC POWER JACK, BKZ LOCKING SERIES, 2.5MM SURFACE MOUNT 99AC7761; HEIGHT: 11mm; MANUFACTURER_NAME: Switchcraft; MANUFACTURER_PART_NUMBER: RASM712BKZ; MOUSER_PART_NUMBER: 502-RASM712BKZ; MOUSER_PRICE-STOCK: https://www.mouser.co.uk/ProductDetail/Switchcraft/RASM712BKZ?qs=vLWxofP3U2yBEWGo0srVpw%3D%3D
J3 = SamacSys_Parts:M50-3600542R: HARWIN Archer M50, 1.27mm Pitch, 10 Way, 2 Row Unshrouded, Right Angle Pin Header, Surface Mount, Solder Termination Source: Datasheet <https://cdn.harwin.com/pdfs/M50-360R.pdf>; DESCRIPTION: HARWIN Archer M50, 1.27mm Pitch, 10 Way, 2 Row Unshrouded, Right Angle Pin Header, Surface Mount, Solder Termination; HEIGHT: mm; MANUFACTURER_NAME: Harwin; MANUFACTURER_PART_NUMBER: M50-3600542R; MOUSER_PART_NUMBER: 855-M50-3600542R; MOUSER_PRICE-STOCK: https://www.mouser.co.uk/ProductDetail/Harwin/M50-3600542R?qs=DVxm2sPGGrrPu%2FxuhpV3yw%3D%3D
J4 = SparkFun-Connectors:CONN_04: Multi connection point. Often used as Generic Header-pin footprint for 0.1 inch spaced/style header connections On any of the 0.1 inch spaced packages, you can populate with these: Break Away Headers - Straight <https://www.sparkfun.com/products/116> (PRT-00116) Break Away Male Headers - Right Angle <https://www.sparkfun.com/products/553> (PRT-00553) Female Headers <https://www.sparkfun.com/products/115> (PRT-00115) Break Away Headers - Machine Pin <https://www.sparkfun.com/products/117> (PRT-00117) Break Away Female Headers - Swiss Machine Pin <https://www.sparkfun.com/products/743> (PRT-00743) For SCREWTERMINALS and SPRING TERMINALS visit here: Screw Terimnals on SparkFun.com <https://www.sparkfun.com/search/results?term=Screw+Terminals> (5mm/3.5mm/2.54mm spacing) This device is also useful as a general connection point to wire up your design to another part of your project. Our various solder wires solder well into these plated through hole pads. Hook-Up Wire - Assortment (Stranded, 22 AWG) <https://www.sparkfun.com/products/11375> (PRT-11375) Hook-Up Wire - Assortment (Solid Core, 22 AWG) <https://www.sparkfun.com/products/11367> (PRT-11367) View the entire wire category on our website here <https://www.sparkfun.com/categories/141> Special notes: Molex polarized connector foot print use with SKU : PRT-08231 with associated crimp pins and housings. 1MM SMD Version SKU: PRT-10208; PROD_ID: CONN-10310; SF_ID: PRT-10208
JP1-JP4 = pinhead:PINHD-1X16: PIN HEADER
JP5 JP7 = pinhead:PINHD-1X2: PIN HEADER
JP6 JP9 = pinhead:PINHD-1X8: PIN HEADER
JP10-JP13 JP17-JP19 = pinhead:PINHD-1X4: PIN HEADER
JP14 = pinhead:PINHD-1X5: PIN HEADER
JP15 JP16 = pinhead:PINHD-1X9: PIN HEADER
L1 = SamacSys_Parts:CBC3225T4R7MR: CBC3225T4R7MR Source: Datasheet <https://ds.yuden.co.jp/TYCOMPAS/ut/detail?pn=CBC3225T4R7MR &u=M>; ARROW_PART_NUMBER: CBC3225T4R7MR; ARROW_PRICE-STOCK: https://www.arrow.com/en/products/cbc3225t4r7mr/taiyo-yuden; DESCRIPTION: CBC3225T4R7MR; HEIGHT: 2.7mm; MANUFACTURER_NAME: TAIYO YUDEN; MANUFACTURER_PART_NUMBER: CBC3225T4R7MR; MOUSER_PART_NUMBER: 963-CBC3225T4R7MR; MOUSER_PRICE-STOCK: https://www.mouser.co.uk/ProductDetail/Taiyo-Yuden/CBC3225T4R7MR?qs=I6KAKw0tg2xjmWcWwswk9Q%3D%3D
LED1 = SamacSys_Parts:BR1101W-TR: Standard LEDs - SMD Surface Mount LED Source: Datasheet <https://media.digikey.com/pdf/Data Sheets/Stanley Electric PDFs/1101W_Series.pdf>; DESCRIPTION: Standard LEDs - SMD Surface Mount LED; HEIGHT: 1.9mm; MANUFACTURER_NAME: Stanley Electric; MANUFACTURER_PART_NUMBER: BR1101W-TR; MOUSER_PART_NUMBER: 327-BR1101WTR; MOUSER_PRICE-STOCK: https://www.mouser.co.uk/ProductDetail/Stanley-Electric/BR1101W-TR?qs=byeeYqUIh0Pp62ktTXSSvA%3D%3D
PS1 = SamacSys_Parts:MIC5317-3.3YM5-TR: LDO Voltage Regulators Single LDO, Hi-Perf. 150mA, 3.3 Vout Source: Datasheet; DESCRIPTION: LDO Voltage Regulators Single LDO, Hi-Perf. 150mA, 3.3 Vout; HEIGHT: 1mm; MANUFACTURER_NAME: Microchip; MANUFACTURER_PART_NUMBER: MIC5317-3.3YM5-TR; MOUSER_PART_NUMBER: 998-MIC5317-3.3YM5TR; MOUSER_PRICE-STOCK: https://www.mouser.co.uk/ProductDetail/Microchip-Technology-Micrel/MIC5317-33YM5-TR?qs=U6T8BxXiZAUR0BSg3XdMLw%3D%3D
R1-R13 R15 = rcl:R-US_: RESISTOR, American symbol; SPICEPREFIX: R
S1 = SamacSys_Parts:452403012014: Slide Switches WS-SLSV Slide Switch SMD 7.65mm x 5.5mm Source: Datasheet <https://katalog.we-online.de/em/datasheet/452403012014.pdf>; DESCRIPTION: Slide Switches WS-SLSV Slide Switch SMD 7.65mm x 5.5mm; HEIGHT: 3.3mm; MANUFACTURER_NAME: Wurth Elektronik; MANUFACTURER_PART_NUMBER: 452403012014; MOUSER_PART_NUMBER: 710-452403012014; MOUSER_PRICE-STOCK: https://www.mouser.co.uk/ProductDetail/Wurth-Elektronik/452403012014?qs=DvsTirrhYfOi0QxHyAEO3w%3D%3D
S2-S5 = SamacSys_Parts:1301.9315: SCHURTER - 1301.9315 - SWITCH, SMD, PUSH, 5MM Source: Datasheet <https://ch.schurter.com/en/datasheet/typ_6x6_mm_tact_switches.pdf>; DESCRIPTION: SCHURTER - 1301.9315 - SWITCH, SMD, PUSH, 5MM; HEIGHT: 9mm; MANUFACTURER_NAME: SCHURTER; MANUFACTURER_PART_NUMBER: 1301.9315; MOUSER_PART_NUMBER: 693-1301.9315; MOUSER_PRICE-STOCK: https://www.mouser.co.uk/ProductDetail/Schurter/13019315?qs=tGaZrb6HVSaeSttQbZxh%2FA%3D%3D
U1 = LPC55S14JBD64E:LPC55S14JBD64E; COPYRIGHT: Copyright (C) 2021 Ultra Librarian. All rights reserved.; MANUFACTURER_PART_NUMBER: LPC55S14JBD64E; MFR_NAME: NXP
U2 = SN65HVD231QDR:SN65HVD231QDR: Check prices <https://pricing.snapeda.com/parts/SN65HVD231QDR/Texas%20Instruments/view-part?ref=eda>; AVAILABILITY: In Stock; DESCRIPTION: 3.3-V CAN Transceiver with Sleep Mode 8-SOIC -40 to 125; MF: Texas Instruments; MP: SN65HVD231QDR; PACKAGE: SOIC-8 Texas Instruments; PRICE: None; PURCHASE-URL: https://pricing.snapeda.com/search/part/SN65HVD231QDR/?ref=eda
U3 = 48LM01-I_SM:48LM01-I/SM; COPYRIGHT: Copyright (C) 2021 Ultra Librarian. All rights reserved.; DIGI-KEY_PART_NUMBER_1: 150-48LM01-I/SM-ND; MANUFACTURER_PART_NUMBER: 48LM01-I/SM; MFR_NAME: Microchip
U4 = ESP-WROOM-02:ESP-WROOM-02: Wi-Fi Module w/ESP8266 802.11b/g/n 20dBm 20x18x3mm; DESCRIPTION: WiFi 802.11b/g/n Transceiver Module 2.4GHz ~ 2.5GHz Integrated, Trace Surface Mount; DIGI-KEY_PART_NUMBER: 1904-1009-1-ND; MF: Espressif Systems; MP: ESP-WROOM-02; PACKAGE: SMD-18 Espressif Systems; PURCHASE-URL: https://pricing.snapeda.com/search/part/ESP-WROOM-02/?ref=eda

## Board
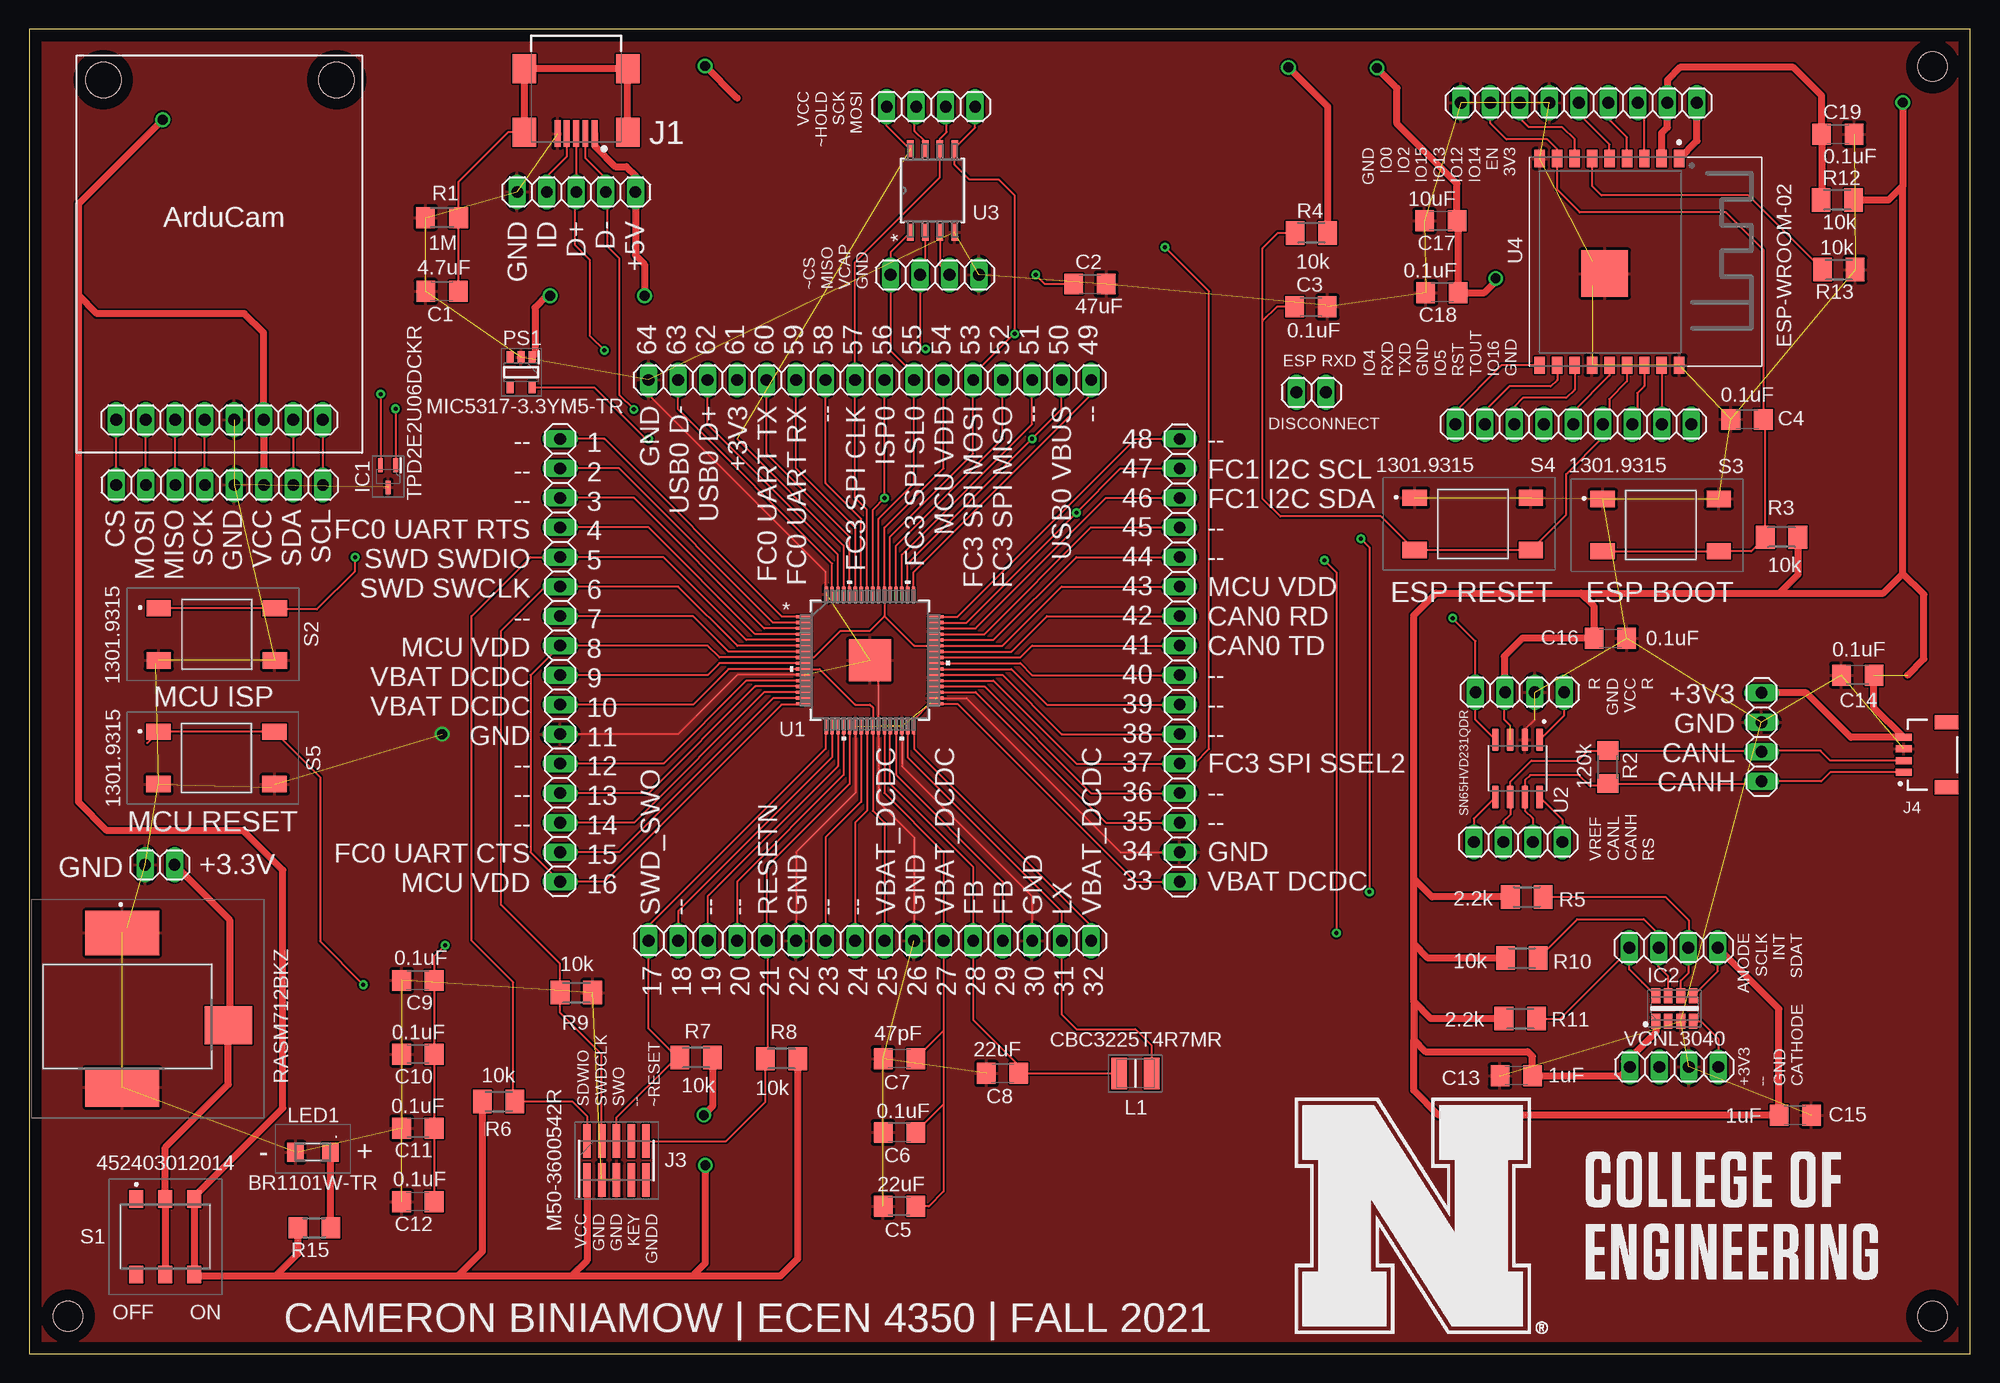
[diagram p8: board, top side]
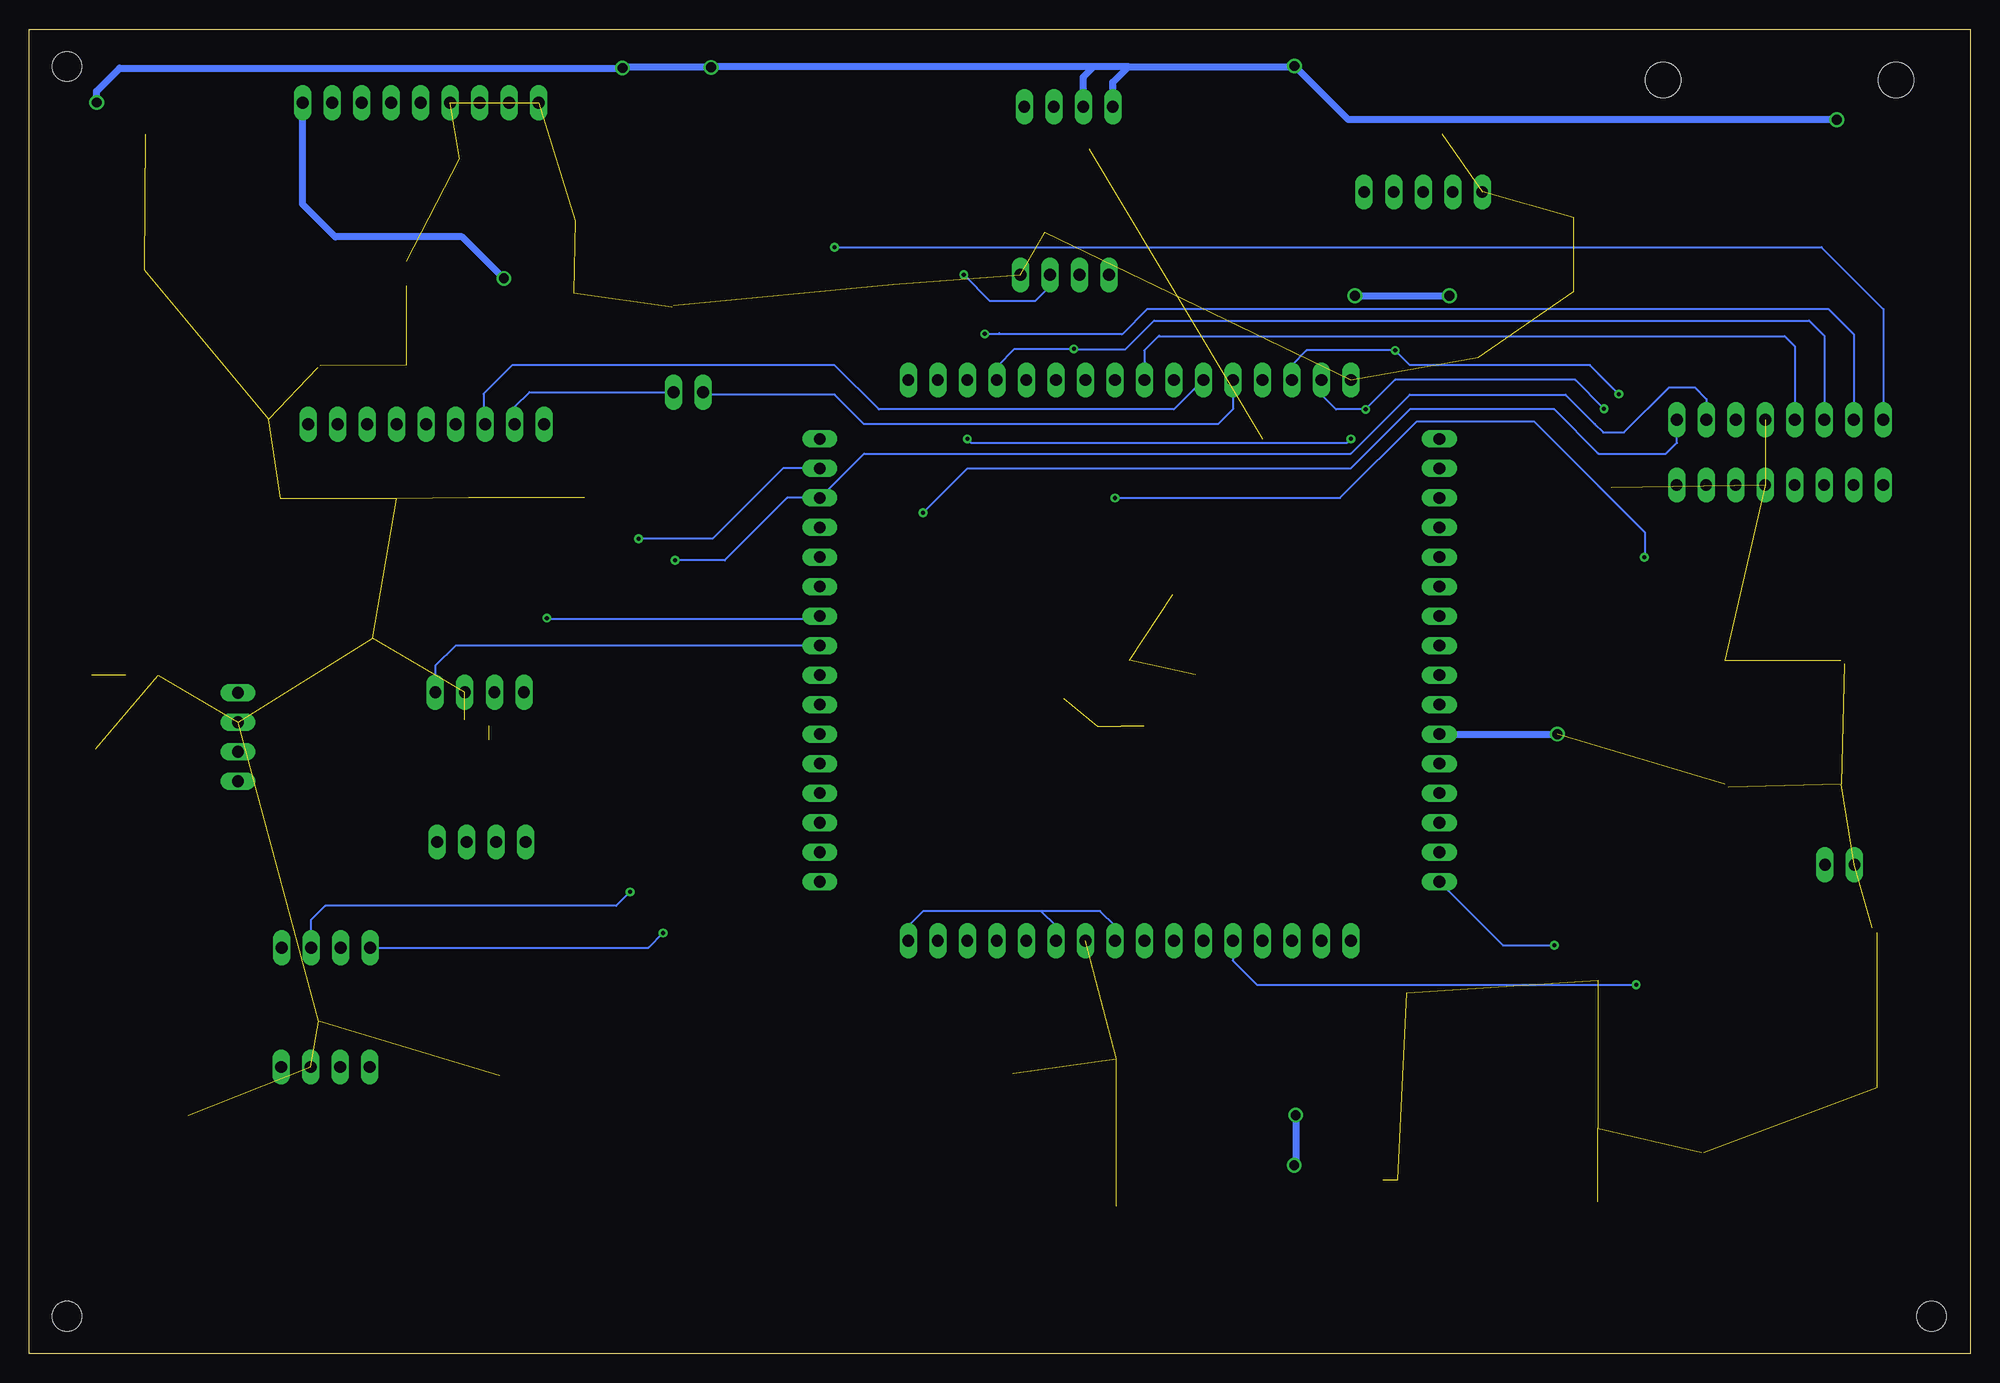
[diagram p9: board, bottom side, seen from below]

Size 167.14 x 114.02 mm. Coordinates in mm from the lower left corner, seen from the top.
Outline: 0,0 167.14,0 167.14,114.02 0,114.02 0,0
Copper layers (1*16): Top 0.035mm / dielectric 1.5mm / Bottom 0.035mm
Design rules "default": minimum track width 6mil, minimum drill 0.35mm, track to track 6mil, track to pad 6mil, pad to pad 6mil, via to via 6mil, smd to smd 6mil, copper to edge 40mil, drill to drill 6mil, minimum pad ring 10mil, minimum via ring 8mil, stop-mask expansion 4mil, vias tented up to drill 0mil, thermal gap 10mil
Holes 2.54 mm at 163.88,110.79 163.88,3.23 3.35,3.23
Holes 3.05 mm at 26.47,109.65 6.4,109.65

### Footprints (pad centres in the part's own frame; a part is rotated, then mirrored left to right if it is on the bottom)
C1206 = smd 1.6 x 1.8: 1 -1.4,0; 2 1.4,0
SOT65P210X110-3N = smd 1.2 x 0.4: 1 -0.95,0.65; 2 -0.95,-0.65; 3 0.95,0
SON108P200X400X115-8N = smd 1.281 x 0.75: 1 -1.091,1.612; 2 -1.091,0.538; 3 -1.091,-0.538; 4 -1.091,-1.612; 5 1.091,-1.612; 6 1.091,-0.538; 7 1.091,0.538; 8 1.091,1.612
GCT_USB2066-05-RBHM-XX-STB-00-00-A_REVD = smd 0.5 x 2.3: 1 -1.6,2.6; 2 -0.8,2.6; 3 0,2.6; 4 0.8,2.6; 5 1.6,2.6 | smd 2 x 2.5: 6 4.45,-3; 7 4.45,2.5; 8 -4.45,-3; 9 -4.45,2.5
RASM712BKZ = smd 3.81 x 6.35: 1 -7.19,-1.17 | smd 3.3 x 6.35: 2 6.1,-1.17 | smd 3.3 x 4.06: 3 0.76,7.97
HUSSP10W40P127_2X5_635X340X420 = smd 0.65 x 2.85: 1 -2.54,-1.675; 2 -2.54,1.675; 3 -1.27,-1.675; 4 -1.27,1.675; 5 0,-1.675; 6 0,1.675; 7 1.27,-1.675; 8 1.27,1.675; 9 2.54,-1.675; 10 2.54,1.675
JST04_1MM_RA = smd 0.6 x 1.35: 1 -1.5,0; 2 -0.5,0; 3 0.5,0; 4 1.5,0 | smd 1.2 x 2: NC1 2.8,-3.675; NC2 -2.8,-3.675
1X16 = drill 1.016 long: 1 -19.05,0; 2 -16.51,0; 3 -13.97,0; 4 -11.43,0; 5 -8.89,0; 6 -6.35,0; 7 -3.81,0; 8 -1.27,0; 9 1.27,0; 10 3.81,0; 11 6.35,0; 12 8.89,0; 13 11.43,0; 14 13.97,0; 15 16.51,0; 16 19.05,0
1X02 = drill 1.016 long: 1 -1.27,0; 2 1.27,0
1X08 = drill 1.016 long: 1 -8.89,0; 2 -6.35,0; 3 -3.81,0; 4 -1.27,0; 5 1.27,0; 6 3.81,0; 7 6.35,0; 8 8.89,0
1X04 = drill 1.016 long: 1 -3.81,0; 2 -1.27,0; 3 1.27,0; 4 3.81,0
1X05 = drill 1.016 long: 1 -5.08,0; 2 -2.54,0; 3 0,0; 4 2.54,0; 5 5.08,0
1X09 = drill 1.016 long: 1 -10.16,0; 2 -7.62,0; 3 -5.08,0; 4 -2.54,0; 5 0,0; 6 2.54,0; 7 5.08,0; 8 7.62,0; 9 10.16,0
INDC3225X270N = smd 1.3 x 2.7: 1 -1.4,0; 2 1.4,0
BR1101WTR = smd 1.6 x 1.4: 1 0,1.5; 2 0,-1.5
SOT95P280X100-5N = smd 1.05 x 0.6: 1 -1.3,0.95; 2 -1.3,0; 3 -1.3,-0.95; 4 1.3,-0.95; 5 1.3,0.95
R1206 = smd 1.6 x 1.803: 1 -1.422,0; 2 1.422,0
M1206 = smd 1.6 x 2: 1 -1.4,0; 2 1.4,0
452403012014 = smd 1.2 x 1.5: 1 -2.5,3.25; 2 0,3.25; 3 2.5,3.25; 4 -2.5,-3.25; 5 0,-3.25; 6 2.5,-3.25
13019319 = smd 2.1 x 1.4: 1 -4.15,2.25; 2 5.85,2.25; 3 -4.15,-2.25; 4 5.85,-2.25
HTQFP64_10X10_NXP = smd 1.346 x 0.279: 1 -5.677,3.75; 2 -5.677,3.25; 3 -5.677,2.75; 4 -5.677,2.25; 5 -5.677,1.75; 6 -5.677,1.25; 7 -5.677,0.75; 8 -5.677,0.25; 9 -5.677,-0.25; 10 -5.677,-0.75; 11 -5.677,-1.25; 12 -5.677,-1.75; 13 -5.677,-2.25; 14 -5.677,-2.75; 15 -5.677,-3.25; 16 -5.677,-3.75; 33 5.677,-3.75; 34 5.677,-3.25; 35 5.677,-2.75; 36 5.677,-2.25; 37 5.677,-1.75; 38 5.677,-1.25; 39 5.677,-0.75; 40 5.677,-0.25; 41 5.677,0.25; 42 5.677,0.75; 43 5.677,1.25; 44 5.677,1.75; 45 5.677,2.25; 46 5.677,2.75; 47 5.677,3.25; 48 5.677,3.75 | smd 0.279 x 1.346: 17 -3.75,-5.677; 18 -3.25,-5.677; 19 -2.75,-5.677; 20 -2.25,-5.677; 21 -1.75,-5.677; 22 -1.25,-5.677; 23 -0.75,-5.677; 24 -0.25,-5.677; 25 0.25,-5.677; 26 0.75,-5.677; 27 1.25,-5.677; 28 1.75,-5.677; 29 2.25,-5.677; 30 2.75,-5.677; 31 3.25,-5.677; 32 3.75,-5.677; 49 3.75,5.677; 50 3.25,5.677; 51 2.75,5.677; 52 2.25,5.677; 53 1.75,5.677; 54 1.25,5.677; 55 0.75,5.677; 56 0.25,5.677; 57 -0.25,5.677; 58 -0.75,5.677; 59 -1.25,5.677; 60 -1.75,5.677; 61 -2.25,5.677; 62 -2.75,5.677; 63 -3.25,5.677; 64 -3.75,5.677 | smd 3.607 x 3.607: EPAD 0,0
SOIC127P599X175-8N = smd 1.97 x 0.6: 1 -2.47,1.905; 2 -2.47,0.635; 3 -2.47,-0.635; 4 -2.47,-1.905; 5 2.47,-1.905; 6 2.47,-0.635; 7 2.47,0.635; 8 2.47,1.905
SOIJ8_SM_MCH = smd 1.473 x 0.559: 1 -3.594,1.905; 2 -3.594,0.635; 3 -3.594,-0.635; 4 -3.594,-1.905; 5 3.594,-1.905; 6 3.594,-0.635; 7 3.594,0.635; 8 3.594,1.905
MODULE_ESP-WROOM-02 = smd 1.485 x 0.9: 1 -8.893,4.9; 2 -8.893,3.4; 3 -8.893,1.9; 4 -8.893,0.4; 5 -8.893,-1.1; 6 -8.893,-2.6; 7 -8.893,-4.1; 8 -8.893,-5.6; 9 -8.893,-7.1; 10 8.893,-7.1; 11 8.893,-5.6; 12 8.893,-4.1; 13 8.893,-2.6; 14 8.893,-1.1; 15 8.893,0.4; 16 8.893,1.9; 17 8.893,3.4; 18 8.893,4.9 | smd 4 x 4: 19 1,-1.5

### Placement (x,y rotation side)
C1  35.56,91.44 180 top
C2  91.34,92.08 0 top
C3  110.36,90.12 0 top
C4  147.9,80.42 180 top
C5  74.93,12.7 180 top
C6  74.93,19.05 180 top
C7  74.93,25.4 180 top
C8  83.82,24.13 180 top
C9  33.48,32.13 180 top
C10  33.48,25.78 180 top
C11  33.48,19.43 180 top
C12  33.48,13.08 180 top
C13  128.04,23.93 180 top
C14  157.43,58.42 180 top
C15  152.04,20.55 0 top
C16  136.14,61.6 0 top
C17  121.54,97.51 180 top
C18  121.64,91.34 180 top
C19  155.73,104.98 0 top
IC1  30.91,75.51 270 top
IC2  141.66,29.72 90 top
J1  47.09,107.62 180 top
J2  9.19,29.03 270 top
J3  50.57,16.64 0 top
J4  161.39,51.56 90 top
JP1  45.72,59.69 270 top
JP2  72.39,35.56 0 top
JP3  99.06,59.69 90 top
JP4  72.39,83.82 180 top
JP5  110.39,82.75 0 top
JP6  16.38,80.39 0 top
JP7  11.25,42.09 0 top
JP9  16.41,74.78 0 top
JP10  77.65,107.34 0 top
JP11  77.98,92.86 0 top
JP12  141.63,24.69 0 top
JP13  141.58,34.95 0 top
JP14  47.12,100 180 top
JP15  133.43,107.67 180 top
JP16  132.94,80.01 0 top
JP17  128.19,44.04 0 top
JP18  128.35,56.95 180 top
JP19  149.15,53.09 270 top
L1  95.25,24.13 0 top
LED1  24.43,17.35 270 top
PS1  42.37,84.48 270 top
R1  35.56,97.79 0 top
R2  135.92,50.5 270 top
R3  150.88,70.28 0 top
R4  110.41,96.47 0 top
R5  128.93,39.32 180 top
R6  40.41,21.72 180 top
R7  57.43,25.5 0 top
R8  64.77,25.4 0 top
R9  47.12,31.09 180 top
R10  128.52,34.06 180 top
R11  128.37,28.85 180 top
R12  155.68,99.31 0 top
R13  155.8,93.32 180 top
R15  24.56,10.85 180 top
S1  11.73,10.08 0 top
S2  15.32,61.93 0 top
S3  139.62,71.32 0 top
S4  123.44,71.42 0 top
S5  15.29,51.28 0 top
U1  72.39,59.69 0 top
U2  128.14,50.39 270 top
U3  77.77,100.13 90 top
U4  137.16,93.98 270 top

### Tracks (layer width: path | path; a pad name or v marks a point on that pad's centre or on a via)
1
  Top 0.152: U1.1 64.83,63.44 49.53,78.74 JP1.1
2
  Top 0.152: U1.2 64.06,62.94 50.8,76.2 JP1.2
3
  Top 0.152: U1.3 63.29,62.44 52.07,73.66 JP1.3
7
  Top 0.152: U1.7 60.21,60.44 57.15,63.5 JP1.7
12
  Top 0.152: U1.12 61.75,57.94 54.61,50.8 JP1.12
13
  Top 0.152: U1.13 62.52,57.44 53.34,48.26 JP1.13
14
  Top 0.152: U1.14 63.29,56.94 52.07,45.72 JP1.14
18
  Top 0.152: U1.18 69.14,51.36 55.88,38.1 JP2.2
19
  Top 0.152: U1.19 69.64,50.59 58.42,39.37 JP2.3
20
  Top 0.152: U1.20 70.14,49.82 60.96,40.64 JP2.4
23
  Top 0.152: U1.23 71.64,47.51 68.58,44.45 JP2.7
24
  Top 0.152: U1.24 72.14,46.74 71.12,45.72 JP2.8
35
  Top 0.152: U1.35 81.49,56.94 92.71,45.72 JP3.3
36
  Top 0.152: U1.36 82.26,57.44 91.44,48.26 JP3.4
38
  Top 0.152: U1.38 83.8,58.44 88.9,53.34 JP3.6
39
  Top 0.152: U1.39 84.57,58.94 87.63,55.88 JP3.7
40
  Top 0.152: U1.40 85.34,59.44 86.36,58.42 JP3.8
44
  Top 0.152: U1.44 83.03,61.44 90.17,68.58 JP3.12
45
  Top 0.152: U1.45 82.26,61.94 91.44,71.12 JP3.13
48
  Top 0.152: U1.48 79.95,63.44 95.25,78.74 JP3.16
49
  Top 0.152: U1.49 76.14,67.25 91.44,82.55 JP4.1
51
  Top 0.152: U1.51 75.14,68.79 86.36,80.01 JP4.3
58
  Top 0.152: U1.58 71.64,71.87 68.58,74.93 JP4.10
+3V3  (via drill 0.85)  (3 unrouted)
  Top 0.152: IC2.5 145.39,32.93 JP13.4 | 127.51,54.08 127,54.58 127,56.69 127,56.87 JP18.3 | U3.8 75.79,103.72 73.84,105.68 JP10.1 | U3.7 77.14,104.34 76.25,105.23 76.25,107.21 JP10.2 | U1.61 70.14,69.56 60.96,78.74 | 20.14,80.34 JP6.6
  Top 0.61: JP12.1 137.82,25.45 140.04,27.67 IC2.1 | JP12.1 137.34,25.17 | JP12.1 137.79,24.71 | 119.2,30.33 119.2,35.31 | 119.2,35.31 119.2,40.89 | 119.2,40.89 119.2,63.55 121.13,65.48 133.6,65.48 | 133.6,65.48 150.7,65.48 | U4.1 143.59,104.4 JP15.1 | R5.2 120.78,39.32 119.2,40.89 | R10.2 120.45,34.06 119.2,35.31 | R11.2 120.68,28.85 119.2,30.33 | JP12.1 137.06,23.93 C13.1 129.44,25.6 129.03,26.01 120.22,26.01 119.2,27.03 | 119.2,30.33 119.2,27.03 | v11.51,106.22 4.27,98.98 4.27,91.11 | 4.27,91.11 4.27,47.47 6.71,45.03 18.44,45.03 21.84,41.63 21.84,21.15 14.23,13.54 S1.3 S1.6 14.36,6.71 21.23,6.71 | 66.04,25.27 R8.2 66.17,8.18 64.69,6.71 57.12,6.71 | 21.23,6.71 36.93,6.71 | 36.93,6.71 46.71,6.71 | 46.71,6.71 57.12,6.71 | J3.1 48.03,8.03 46.71,6.71 | R6.2 39.01,8.79 36.93,6.71 | R7.2 58.83,21.29 v58.09,20.55 | v58.22,16.23 58.22,7.8 57.12,6.71 | v126.26,92.56 126.26,92.3 125.3,91.34 C18.1 123.04,97.41 C17.1 122.94,100.71 117.78,105.87 117.78,108.94 v116.05,110.67 | R4.2 111.81,107.34 v108.43,110.72 | v161.32,107.7 161.32,100.53 | R12.2 160.1,99.31 161.32,100.53 | 161.32,67.16 161.32,100.53 | 150.7,65.48 159.64,65.48 161.32,67.16 | R3.2 152.28,67.06 150.7,65.48 | 133.6,65.48 134.74,64.34 C16.1 128.57,61.59 127,60.02 127,56.69 | 119.2,27.03 119.2,22.68 121.34,20.55 C15.1 150.64,29.7 JP13.4 | 161.32,67.16 163.12,65.35 163.12,59.82 161.72,58.42 | 60.96,108.08 v58.19,110.85 | 4.27,91.11 5.84,89.53 18.54,89.53 20.19,87.88 JP6.6 20.19,74.8 JP9.6 | R15.2 23.14,8.61 21.23,6.71 | C14.1 158.83,55.62 J4.4 156.84,53.06 153.01,56.9 JP19.1
  Bottom 0.61: JP10.1 73.84,109.45 72.49,110.79 | v58.09,20.55 58.09,16.36 v58.22,16.23 | v126.26,92.56 129.84,96.14 140.77,96.14 143.59,98.96 JP15.1 | v116.05,110.67 115.93,110.79 | v108.43,110.72 108.79,110.72 | 108.79,110.72 116,110.72 v116.05,110.67 | 72.49,110.79 75.49,110.79 | 75.49,110.79 108.71,110.79 108.79,110.72 | v116.05,110.67 159.33,110.67 161.32,108.69 v161.32,107.7 | JP10.2 76.38,109.91 75.49,110.79 | 72.49,110.79 58.24,110.79 v58.19,110.85 53.57,106.22 v11.51,106.22
+5V  (via drill 0.85)
  Top 0.152: J1.1 48.69,103.88 | 52.2,100.37 JP14.1
  Top 0.61: PS1.1 43.56,86.02 43.56,90.04 44.58,91.06 v44.86,91.06 | v52.98,91.06 52.98,93.78 52.2,94.56 JP14.1 52.2,101.4 51.41,102.18 50.47,102.18 48.69,103.96 J1.1
  Bottom 0.61: v52.98,91.06 52.96,91.08 44.88,91.08 v44.86,91.06
CAN0_RD  (via drill 0.35)
  Top 0.152: U1.42 84.57,60.44 87.63,63.5 JP3.10 | U2.4 124.54,54.57 JP18.4 124.54,61.34 v122.55,63.32
  Bottom 0.152: JP3.10 99.29,63.27 122.5,63.27 v122.55,63.32
CAN0_TD
  Top 0.152: U1.41 85.34,59.94 86.36,60.96 JP3.9 | U2.1 132.16,54.97 JP18.1
  Bottom 0.152: 99.62,60.4 JP3.9 130.4,60.96 132.16,59.21 JP18.1
CAN_HIGH_BUS
  Top 0.152: JP17.3 129.46,46.08 128.78,46.76 U2.7 128.78,49.35 129.23,49.81 133.43,49.81 134.31,48.92 136.09,48.92 136.25,49.07 R2.2 148.95,49.07 JP19.4 154.28,49.28 155.09,50.09 161.36,50.09 J4.1
CAN_LOW_BUS
  Top 0.152: 135.97,51.87 R2.1 | JP17.2 126.92,45.82 127.51,46.41 U2.6 127.51,49.22 129.34,51.05 133.32,51.05 134.19,51.92 R2.1 | J4.2 155.08,51.06 154.23,51.92 149.05,51.92 | R2.1 149.05,51.92 | 149.05,51.92 JP19.3
FB
  Top 0.152: JP2.13 83.82,40.64 74.64,49.82 U1.29 U1.28 74.14,49.05 81.28,41.91 JP2.12 81.28,28.75 85.22,24.81 C8.1 93.7,24.13 93.78,24.05 L1.1 93.98,24.26 93.98,25.4
FC0_UART_CTS
  Top 0.152: U1.15 64.06,56.44 50.8,43.18 JP1.15
FC0_UART_RTS
  Top 0.152: U1.4 62.52,61.94 53.34,71.12 JP1.4
FC0_UART_RXD
  Top 0.152: U1.59 71.14,71.1 66.04,76.2 JP4.11 | U4.12 133.06,83 132.33,82.27 128.63,82.27 127.86,81.51 JP16.3
  Bottom 0.152: JP4.11 68.58,81.28 93.98,81.28 97.78,85.08 125.56,85.08 128.02,82.63 128.02,80.16 JP16.3
FC0_UART_TXD
  Top 0.152: U1.60 70.64,70.33 63.5,77.47 JP4.12
  Bottom 0.152: JP4.12 63.5,81.28 64.77,80.01 95.25,80.01 97.79,82.55 108.91,82.55 JP5.1
FC1_I2C_SCL  (via drill 0.35)
  Top 0.152: U1.47 80.72,62.94 v90.17,72.39 93.98,76.2 JP3.15 | IC2.6 142.19,32.11 142.87,32.79 142.87,34.92 | 130.28,39.37 R5.1 140.87,39.32 142.87,37.31 142.87,34.92 | v114.66,70.15 115.39,69.42 v115.39,39.75 | 142.87,34.92 JP13.3 | JP6.8 25.27,74.8 JP9.8
  Bottom 0.152: JP3.15 102.23,76.2 108.28,70.15 v114.66,70.15 | v90.17,72.39 86.36,76.2 53.34,76.2 48.26,81.28 35.84,81.28 32.03,77.47 26.21,77.47 25.27,78.41 JP6.8 | JP13.3 142.85,37.34 141.63,38.56 116.59,38.56 v115.39,39.75
FC1_I2C_SDA  (via drill 0.35)
  Top 0.152: U1.46 81.49,62.44 92.71,73.66 JP3.14 | 137.77,34.77 137.77,33.08 IC2.8 138.87,31.98 | 137.77,34.77 JP13.1 | v111.53,68.3 112.55,67.28 v112.55,36.22 | R11.1 131.85,28.85 137.77,34.77 | JP6.7 22.73,74.8 JP9.7
  Bottom 0.152: v111.53,68.3 107.24,68.3 101.88,73.66 JP3.14 95.25,77.47 53.34,77.47 48.26,82.55 34.87,82.55 32.38,80.06 32.33,80.01 31.62,79.3 29.82,79.3 25.93,83.18 23.75,83.18 22.73,82.17 JP6.7 | JP13.1 113.82,34.95 v112.55,36.22
FC3_SPI_MISO  (via drill 0.35)
  Top 0.152: U1.52 74.64,69.56 83.82,78.74 JP4.4 | U3.2 77.14,93.29 JP11.2 76.71,86.77 76.99,86.49 v77.19,86.49 | JP9.3 12.6,80.37 JP6.3
  Bottom 0.152: JP4.4 83.82,84.96 82.3,86.49 v77.19,86.49 77.14,86.44 72.77,86.44 70.28,88.93 13.89,88.93 12.57,87.6 JP6.3
FC3_SPI_MOSI  (via drill 0.35)
  Top 0.152: U1.53 74.14,70.33 81.28,77.47 JP4.5 81.28,84.25 84.81,87.78 v84.86,87.78 84.85,87.79 84.85,99.71 83.46,101.09 80.94,101.09 79.68,102.35 U3.5 79.68,103.76 81.46,105.54 JP10.4 | JP9.2 10.06,80.37 JP6.2
  Bottom 0.152: 73.01,87.77 70.85,89.93 12.23,89.93 10.03,87.73 JP6.2 | 73.01,87.77 73.05,87.73 | 73.01,87.77 83.5,87.77 | 83.5,87.77 83.59,87.86 | 83.5,87.77 84.85,87.77 v84.86,87.78
FC3_SPI_SCK
  Top 0.152: U1.57 72.14,72.64 71.12,73.66 JP4.9 71.12,93.95 78.41,101.24 U3.6 78.41,104.57 78.99,105.16 78.99,107.26 JP10.3 | JP9.4 15.14,80.37 JP6.4
  Bottom 0.152: 69.85,87.63 69.89,87.59 | 69.89,87.59 71.12,86.36 JP4.9 | JP6.4 15.11,86.72 15.99,87.59 69.89,87.59
FC3_SPI_SSEL0
  Top 0.152: U1.55 73.14,71.87 76.2,74.93 JP4.7 76.2,84.3 74.17,86.33 JP11.1 74.17,94.83 U3.1
FC3_SPI_SSEL2  (via drill 0.35)
  Top 0.152: U1.37 83.03,57.94 90.17,50.8 JP3.5 100.33,50.8 101.6,52.07 101.6,91.44 v97.79,95.25 | JP9.1 7.52,80.37 JP6.1
  Bottom 0.152: v97.79,95.25 12.83,95.25 7.49,89.92 JP6.1
GND  (via drill 0.85)  (61 unrouted)
  Top 0.152: JP2.14 86.36,39.37 75.14,50.59 U1.30 | JP2.10 76.2,44.45 73.14,47.51 U1.26 73.14,58.94 U1.EPAD | U1.22 71.14,48.28 66.04,43.18 JP2.6 | U1.11 60.98,58.44 55.88,53.34 JP1.11 | U1.34 80.72,56.44 93.98,43.18 JP3.2 | U1.64 68.58,65.43 68.58,67.31 53.34,82.55 JP4.16 | S2.3 10.88,59.38 | U2.2 128.78,53.75 129.62,54.58
  Top 0.61: 23.16,17.35 LED1.2 | J2.1 8.45,36.65 | S5.4 20.85,48.74 | C5.2 73.66,12.57 | 34.16,97.77 R1.1 | C3.2 111.63,90.25 | 134.62,94.02 U4.19 134.62,91.94 | U4.13 134.62,85.15 | U4.18 142.24,84.91
  Bottom 0.61: JP1.11 v35.56,53.34
  pour Top: 1.02,113.08 166.62,113.08 166.62,0.61 1.02,0.61
ISP0  (via drill 0.35)
  Top 0.152: S2.1 S2.2 21.27,64.07 24.77,64.07 28.07,67.36 v28.07,68.55 | U1.56 72.64,72.64 v73.66,73.66 JP4.8
  Bottom 0.152: v73.66,73.66 54.28,73.66 47.68,80.26 37.59,80.26 28.04,70.71 28.04,68.53 v28.07,68.55
LX
  Top 0.152: U1.31 75.64,51.36 88.9,38.1 JP2.15 88.9,29.21 90.17,27.94 95.25,27.94 96.65,26.54 L1.2
MCU_VDD  (via drill 0.35)
  Top 0.152: U1.16 66.65,55.88 64.77,55.88 49.53,40.64 JP1.16 43.18,43.18 43.18,58.42 JP1.8 58.42,60.96 59.44,59.94 U1.8 67.56,59.94 69.85,62.23 72.39,62.23 73.66,63.5 | C12.1 C11.1 C10.1 C9.1 34.88,34.22 v35.81,35.15 | JP3.11 88.9,66.04 83.8,60.94 U1.43 78.05,60.96 76.2,60.96 73.66,63.5 | JP4.6 78.74,76.2 73.64,71.1 U1.54 73.64,63.52 73.66,63.5
  Bottom 0.152: JP1.16 40.23,35.15 v35.81,35.15
N$1
  Top 0.152: U4.11 131.56,83.81 131.01,83.26 127.43,83.26 125.32,81.15 JP16.2
  Bottom 0.152: JP16.2 125.32,81.51 124.05,82.78 111.68,82.78 JP5.2
N$2
  Top 0.152: IC2.7 141.12,32.49 140.26,33.35 140.26,34.9 JP13.2 140.31,36.12 139.01,37.41 133.28,37.41 R10.1
N$3  (via drill 0.35)
  Top 0.152: C2.1 87.45,92.07 v86.66,92.86 | U3.3 78.41,93.7 JP11.3
  Bottom 0.152: 86.59,92.94 v86.66,92.86 84.4,90.6 80.54,90.6 79.25,91.9 JP11.3
N$4
  Top 0.152: JP12.4 145.44,27.1 143.91,28.63 IC2.4
N$5
  Top 0.152: U2.8 132,45.97 JP17.4
N$6
  Top 0.152: U2.5 124.38,46.07 JP17.1
N$7
  Top 0.152: J1.7 41.24,105.12 36.98,100.86 R1.2 36.96,97.77 C1.1
  Top 0.61: J1.9 J1.8 J1.6 J1.7
N$8
  Top 0.152: 135.18,68.78 S3.3 S3.4 148.27,69.07 R3.1 149.48,80.24 C4.1 | C4.1 149.51,80.42 | JP15.8 125.81,105.92 127.2,104.52 130.71,104.52 131.56,103.67 U4.8 131.56,100.19 133.5,98.25 146.08,98.25 149.29,95.03 149.29,80.43 C4.1
N$9
  Top 0.61: U4.2 140.56,105.08 141.05,105.56 JP15.2 141.05,109.63 142.14,110.72 151.89,110.72 154.33,108.28 C19.1 154.33,99.36 R12.1
N$10
  Top 0.152: U4.3 139.06,107.12 JP15.3
N$11
  Top 0.152: 106.2,88.9 106.2,73.58 107.71,72.07 116.4,72.07 S4.3 S4.4 132.33,72.21 132.33,75.72 135.48,78.87 JP16.6 136.04,80.57 136.04,82.17 137.56,83.69 U4.15 | 106.2,88.9 106.2,95.15 107.52,96.47 R4.1 | C3.1 107.42,90.12 106.2,88.9
N$12
  Top 0.152: J1.4 46.29,103.03 44.58,101.32 JP14.4
N$13
  Top 0.152: U4.4 137.56,104.7 135.89,106.37 135.89,107.59 JP15.4
N$14
  Top 0.152: U4.5 136.06,104.1 133.43,106.73 JP15.5
N$15
  Top 0.152: U4.7 133.06,104.53 132,105.59 129.11,105.59 128.35,106.35 JP15.7
N$16
  Top 0.152: U4.10 126.77,85.09 122.78,81.1 JP16.1
N$17
  Top 0.152: U4.14 136.06,84.22 132.94,81.1 JP16.5
N$18
  Top 0.152: U4.16 139.06,83.28 138.46,82.68 138.46,80.44 JP16.7
N$19
  Top 0.152: U4.17 JP16.8
N$20
  Top 0.61: LED1.1 25.93,10.89 R15.1
N$21
  Top 0.152: U4.6 134.56,100.52 135.38,99.69 148.03,99.69 R13.2
PWR_SRC
  Top 0.61: JP7.2 17.27,37.34 17.27,28.37 J2.3 17.16,23.19 11.73,17.76 S1.2 S1.5
RESETN  (via drill 0.35)
  Top 0.152: U1.21 70.64,49.05 63.5,41.91 JP2.5 63.58,35.48 63.58,25.61 R8.1 63.37,21.66 60.02,18.31 J3.10 | 10.16,52.55 S5.1 S5.2 25.04,49.63 25.04,35.51 v28.78,31.78
  Bottom 0.152: JP2.5 63.5,33.83 61.44,31.78 v28.78,31.78
SWD_SWCLK
  Top 0.152: U1.6 60.98,60.94 55.88,66.04 JP1.6 44.45,66.04 40.64,62.23 40.64,38.79 40.64,38.66 40.64,38.63 45.72,33.56 R9.2 | 46,31.37 R9.2 | J3.4 49.3,25.78 45.72,29.36 R9.2
  Bottom 0.152: JP1.6 45.69,66.01
SWD_SWDIO
  Top 0.152: U1.5 61.75,61.44 54.61,68.58 JP1.5 43.18,68.58 38.1,63.5 38.1,35.56 41.68,31.98 41.68,21.85 R6.1 46.76,21.72 48.03,20.45 J3.2
SWD_SWO
  Top 0.152: U1.17 68.58,53.95 68.58,52.07 53.34,36.83 JP2.1 53.31,35.53 53.31,28.02 55.83,25.5 | J3.6 50.57,20.34 55.73,25.5 55.83,25.5 | 55.83,25.5 R7.1
USB0_D+  (via drill 0.35)
  Top 0.152: U1.62 69.64,68.79 58.42,80.01 JP4.14 | v49.53,86.36 48.26,87.63 48.26,94.16 46.99,95.43 46.99,99.95 47.08,100.04 47.09,100.02 | J1.3 47.09,100.02 | 47.09,100.02 JP14.3 | v30.28,82.6 30.28,76.48 IC1.2
  Bottom 0.152: JP4.14 58.42,85.09 57.15,86.36 v49.53,86.36 48.26,85.09 32.77,85.09 v30.28,82.6
USB0_D-  (via drill 0.35)
  Top 0.152: U1.63 69.14,68.02 55.88,81.28 JP4.15 55.88,85.09 | v52.07,81.28 50.8,82.55 50.8,94.28 49.77,95.31 49.77,99.89 JP14.2 49.66,101.17 47.89,102.93 J1.2 | v31.55,81.33 31.55,76.48 IC1.1
  Bottom 0.152: v31.55,81.33 34.04,83.82 49.53,83.82 v52.07,81.28 54.61,81.28 55.88,82.55 JP4.15
USB0_VBUS  (via drill 0.35)
  Top 0.152: U1.50 75.64,68.02 v86.36,78.74 88.9,81.28 JP4.2 | PS1.5 48.65,83.18 53.09,78.74 v53.34,78.74
  Bottom 0.152: v53.34,78.74 53.64,78.43 86.05,78.43 v86.36,78.74
VBAT_DCDC
  Top 0.152: JP2.16 91.44,36.83 76.2,52.07 76.2,53.95 U1.32 76.14,54.55 77.53,55.94 U1.33 79.95,55.94 95.25,40.64 JP3.1 | U1.27 73.64,48.28 78.74,43.18 JP2.11 78.74,27.81 | JP2.9 73.66,45.72 72.64,46.74 U1.25 72.64,55.63 72.39,55.88 71.12,55.88 68.06,58.94 U1.10 | U1.10 60.21,58.94 57.15,55.88 JP1.10 | JP1.9 58.42,58.42 59.44,59.44 U1.9 U1.10 | 78.74,27.81 78.74,21.46 | 78.74,21.46 78.74,13.97 77.47,12.7 C5.1 | C6.1 78.74,21.46 | C7.1 78.74,27.81
  Bottom 0.152: JP2.9 73.66,36.83 74.93,38.1 80.01,38.1 | JP2.11 78.74,36.83 80.01,38.1 | 80.01,38.1 90.17,38.1 91.44,36.83 JP2.16

### Text on the board
tNames: VCC / ~HOLD / SCK / MOSI | GND / IO0 / IO2 / IO15 / IO13 / IO12 / IO14 / EN / 3V3 | GND / ID / D+ / D- / +5V | ArduCam | ~CS / MISO / VCAP / GND | 64 / 63 / 62 / 61 / 60 / 59 / 58 / 57 / 56 / 55 / 54 / 53 / 52 / 51 / 50 / 49 | ESP RXD | IO4 / RXD / TXD / GND / IO5 / RST / TOUT / IO16 / GND | GND / USB0 D- / USB0 D+ / +3V3 / FC0 UART TX / FC0 UART RX / -- / FC3 SPI CLK / ISP0 / FC3 SPI SL0 / MCU VDD / FC3 SPI MOSI / FC3 SPI MISO / -- / USB0 VBUS / -- | DISCONNECT | CS / MOSI / MISO / SCK / GND / VCC / SDA / SCL | ESP RESET | ESP BOOT | R / GND / VCC / R | MCU ISP | +3V3 / GND / CANL / CANH | SN65HVD231QDR | MCU RESET | VREF / CANL / CANH / RS | +3.3V | GND | -- / -- / -- / FC0 UART RTS / SWD SWDIO / SWD SWCLK / -- / MCU VDD / VBAT DCDC / VBAT DCDC / GND / -- / -- / -- / FC0 UART CTS / MCU VDD | 48 / 47 / 46 / 45 / 44 / 43 / 42 / 41 / 40 / 39 / 38 / 37 / 36 / 35 / 34 / 33 | -- / FC1 I2C SCL / FC1 I2C SDA / -- / -- / MCU VDD / CAN0 RD / CAN0 TD / -- / -- / -- / FC3 SPI SSEL2 / -- / -- / GND / VBAT DCDC | SWD_SWO / -- / -- / -- / RESETN / GND / -- / -- / VBAT_DCDC / GND / VBAT_DCDC / FB / FB / GND / LX / VBAT_DCDC | 1 / 2 / 3 / 4 / 5 / 6 / 7 / 8 / 9 / 10 / 11 / 12 / 13 / 14 / 15 / 16 | ANODE / SCLK / INT / SDAT | 17 / 18 / 19 / 20 / 21 / 22 / 23 / 24 / 25 / 26 / 27 / 28 / 29 / 30 / 31 / 32 | +3V3 / -- / GND / CATHODE | SDWIO / SWDCLK / SWO / -- / ~RESET | - | + | VCC / GND / GND / KEY / GNDD | OFF ON | CAMERON BINIAMOW | ECEN 4350 | FALL 2021